# EAGLE design InkTime (EAGLE 9.7.0)

## Sheet 1 of 2
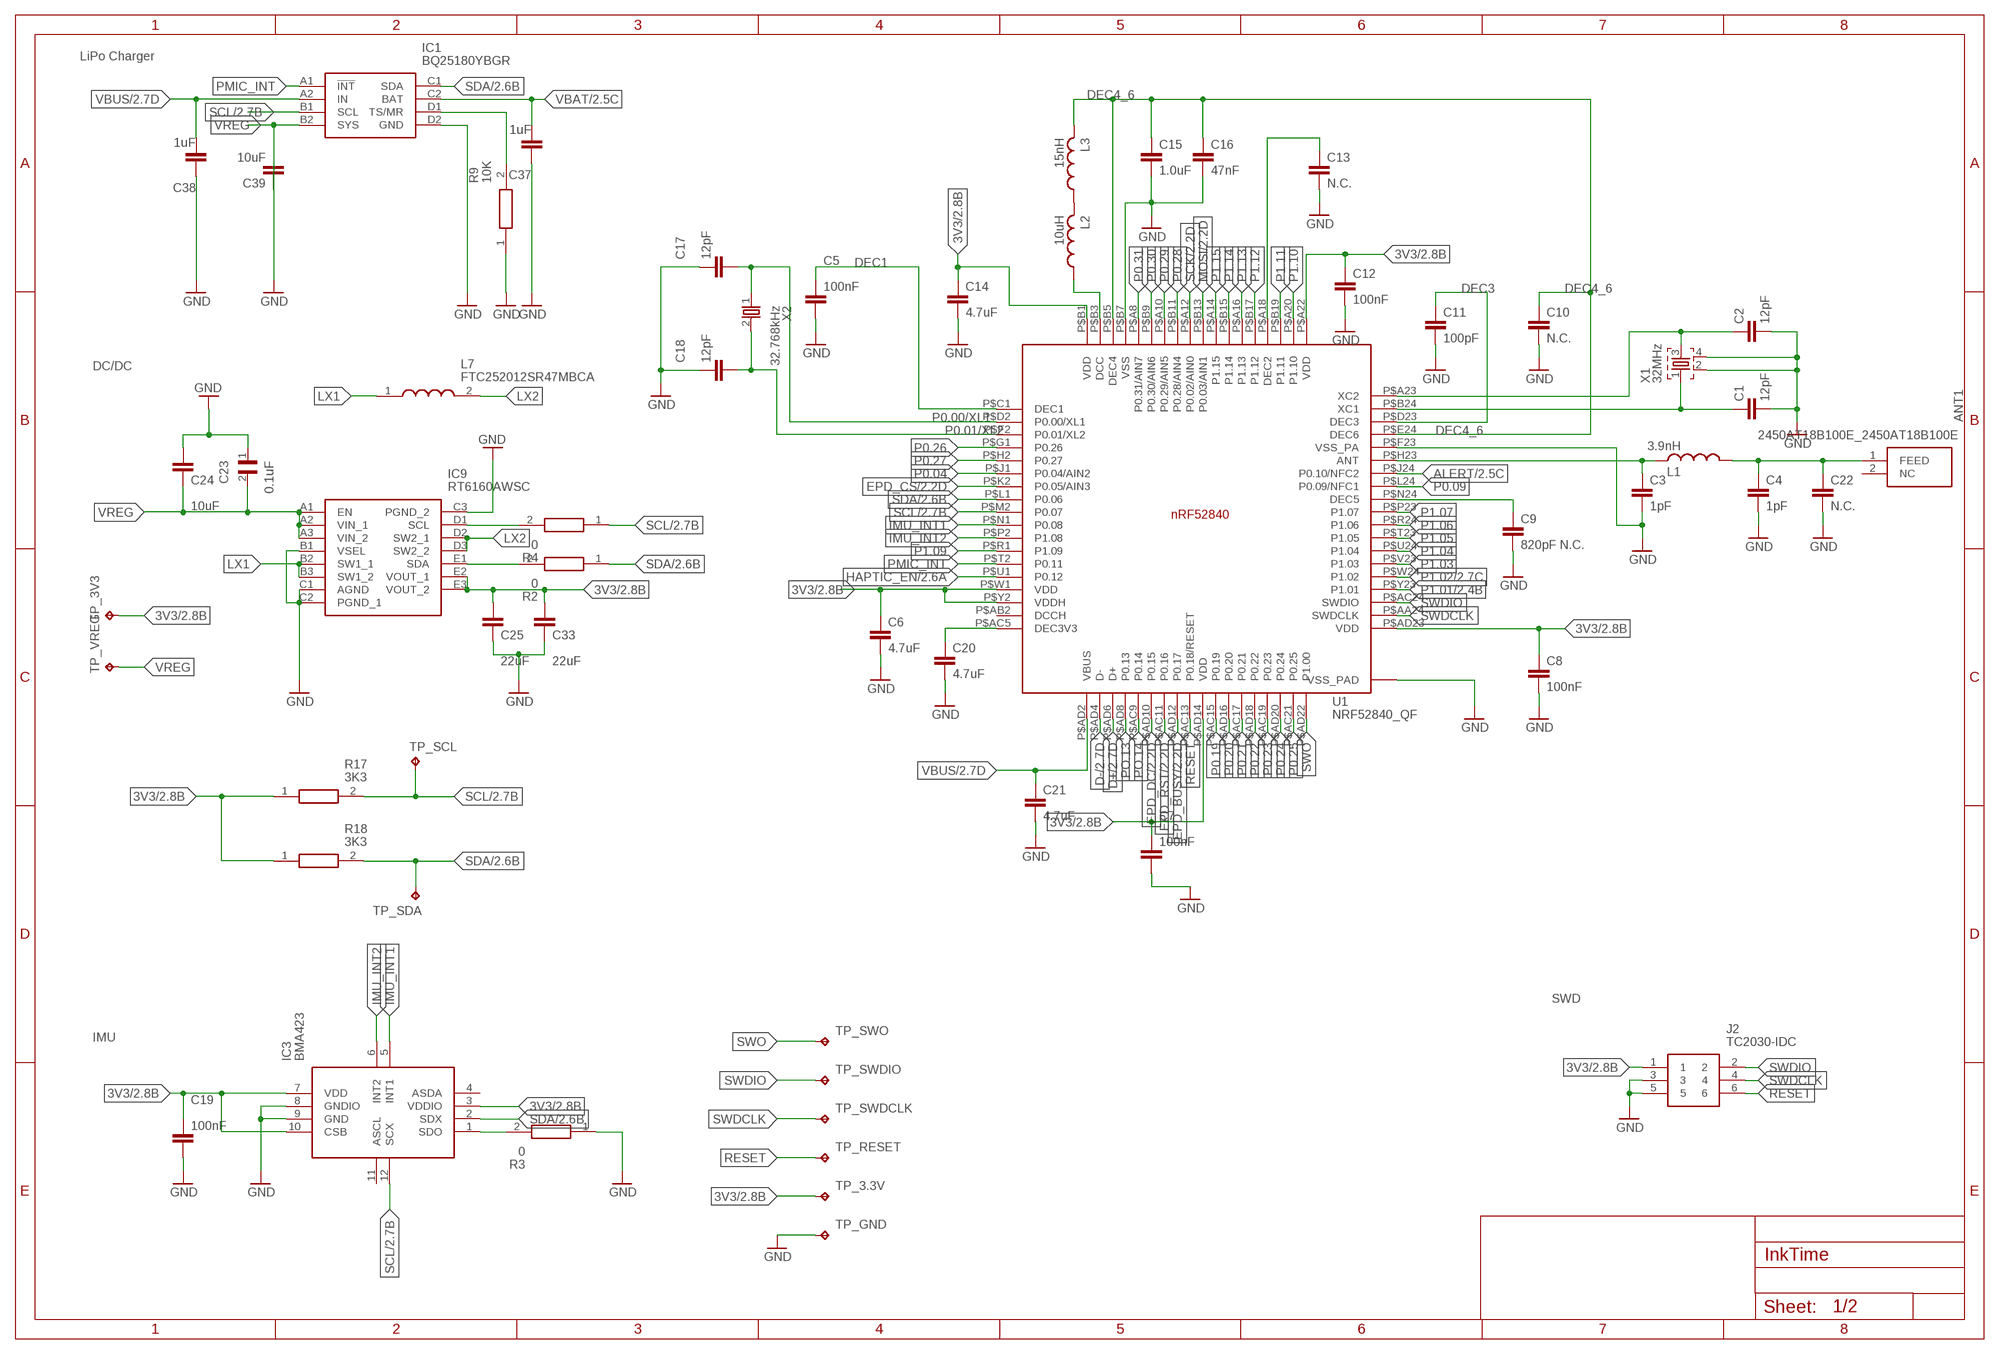
[diagram p0: schematic, sheet 1]

### Parts
ANT1  2450AT18B100E_2450AT18B100E  [2450AT18B100E_ANTC3216X140N]
C1  12pF  NORDIC_NRF_3_CAPACITOR_0201_L  [NORDIC_NRF_3_RESC0201_L]
C2  12pF  NORDIC_NRF_3_CAPACITOR_0201_L  [NORDIC_NRF_3_RESC0201_L]
C3  1pF  NORDIC_NRF_3_CAPACITOR_0201_L  [NORDIC_NRF_3_RESC0201_L]
C4  1pF  NORDIC_NRF_3_CAPACITOR_0201_L  [NORDIC_NRF_3_RESC0201_L]
C5  100nF  NORDIC_NRF_3_CAPACITOR_0201_L  [NORDIC_NRF_3_RESC0201_L]
C6  4.7uF  PERFECT_0402_CAP_0402  [PERFECT_0402_0402]
C7  100nF  NORDIC_NRF_3_CAPACITOR_0201_L  [NORDIC_NRF_3_RESC0201_L]
C8  100nF  NORDIC_NRF_3_CAPACITOR_0201_L  [NORDIC_NRF_3_RESC0201_L]
C9  820pF N.C.  NORDIC_NRF_3_CAPACITOR_0201_L  [NORDIC_NRF_3_RESC0201_L]
C10  N.C.  NORDIC_NRF_3_CAPACITOR_0201_L  [NORDIC_NRF_3_RESC0201_L]
C11  100pF  NORDIC_NRF_3_CAPACITOR_0201_L  [NORDIC_NRF_3_RESC0201_L]
C12  100nF  NORDIC_NRF_3_CAPACITOR_0201_L  [NORDIC_NRF_3_RESC0201_L]
C13  N.C.  NORDIC_NRF_3_CAPACITOR_0201_L  [NORDIC_NRF_3_RESC0201_L]
C14  4.7uF  PERFECT_0402_CAP_0402  [PERFECT_0402_0402]
C15  1.0uF  PERFECT_0402_CAP_0402  [PERFECT_0402_0402]
C16  47nF  NORDIC_NRF_3_CAPACITOR_0201_L  [NORDIC_NRF_3_RESC0201_L]
C17  12pF  NORDIC_NRF_3_CAPACITOR_0201_L  [NORDIC_NRF_3_RESC0201_L]
C18  12pF  NORDIC_NRF_3_CAPACITOR_0201_L  [NORDIC_NRF_3_RESC0201_L]
C19  100nF  NORDIC_NRF_3_CAPACITOR_0201_L  [NORDIC_NRF_3_RESC0201_L]
C20  4.7uF  PERFECT_0402_CAP_0402  [PERFECT_0402_0402]
C21  4.7uF  PERFECT_0402_CAP_0402  [PERFECT_0402_0402]
C22  N.C.  NORDIC_NRF_3_CAPACITOR_0201_L  [NORDIC_NRF_3_RESC0201_L]
C23  0.1uF  GRM011R60J152KE01L_1_GRM011R60J152KE01L  [GRM011R60J152KE01L_1_0201]
C24  10uF  PERFECT_0402_CAP_0402  [PERFECT_0402_0402]
C25  22uF  PERFECT_0402_CAP_0402  [PERFECT_0402_0402]
C33  22uF  PERFECT_0402_CAP_0402  [PERFECT_0402_0402]
C37  1uF  NORDIC_NRF_3_CAPACITOR_0402_L  [NORDIC_NRF_3_RESC0402_L]
C38  1uF  NORDIC_NRF_3_CAPACITOR_0402_L  [NORDIC_NRF_3_RESC0402_L]
C39  10uF  NORDIC_NRF_3_CAPACITOR_0402_L  [NORDIC_NRF_3_RESC0402_L]
IC1  BQ25180YBGR  BQ25180YBGR_BQ25180YBGR  [BQ25180YBGR_BGA8C40P2X4_100X155X50]
IC3  BMA423  BMA423_BMA423  [BMA423_BMA423]
IC9  RT6160AWSC  RT6160AWSC_RT6160AWSC  [RT6160AWSC_BGA15C40P3X5_140X230X60]
J2  TC2030-IDC  TC2030-IDC_TC2030-IDC  [TC2030-IDC_TC2030IDC]
L1  3.9nH  NORDIC_NRF_2_INDUCTOR_0402_L  [NORDIC_NRF_2_RESC0402_L]
L2  10uH  NORDIC_NRF_2_INDUCTOR_0402_L  [NORDIC_NRF_2_RESC0402_L]
L3  15nH  NORDIC_NRF_2_INDUCTOR_0402_L  [NORDIC_NRF_2_RESC0402_L]
L7  FTC252012SR47MBCA  MLP2016SR47MT0S1_FTC252012SR47MBCA  [MLP2016SR47MT0S1_INDC2016X100N]
R2  0  ERA-1AEB3401C_CPF0201D7K68C1  [ERA-1AEB3401C_0201]
R3  0  CPF0201D7K68C1_CPF0201D7K68C1  [CPF0201D7K68C1_0201]
R4  0  ERA-1AEB3401C_CPF0201D7K68C1  [ERA-1AEB3401C_0201]
R9  10K  ERA-1AEB3401C_CPF0201D7K68C1  [ERA-1AEB3401C_0201]
R17  3K3  ERA-1AEB3401C_CPF0201D7K68C1  [ERA-1AEB3401C_0201]
R18  3K3  ERA-1AEB3401C_CPF0201D7K68C1  [ERA-1AEB3401C_0201]
TP_3.3V  HECTOR_WATCH_1_TPTP20R  [HECTOR_WATCH_1_TP20R]
TP_3V3  HECTOR_WATCH_1_TPTP20R  [HECTOR_WATCH_1_TP20R]
TP_GND  HECTOR_WATCH_1_TPTP20R  [HECTOR_WATCH_1_TP20R]
TP_RESET  HECTOR_WATCH_1_TPTP20R  [HECTOR_WATCH_1_TP20R]
TP_SCL  HECTOR_WATCH_1_TPTP20R  [HECTOR_WATCH_1_TP20R]
TP_SDA  HECTOR_WATCH_1_TPTP20R  [HECTOR_WATCH_1_TP20R]
TP_SWDCLK  HECTOR_WATCH_1_TPTP20R  [HECTOR_WATCH_1_TP20R]
TP_SWDIO  HECTOR_WATCH_1_TPTP20R  [HECTOR_WATCH_1_TP20R]
TP_SWO  HECTOR_WATCH_1_TPTP20R  [HECTOR_WATCH_1_TP20R]
TP_VREG  HECTOR_WATCH_1_TPTP20R  [HECTOR_WATCH_1_TP20R]
U1  NRF52840_QF  NORDIC_NRF_4_NRF52840_QF  [NORDIC_NRF_4_AQFN50P700X700X85_HS-74N]
X1  32MHz  NORDIC_NRF_XTAL_32MHZ  [NORDIC_NRF_BT-XTAL_2016_N]
X2  32.768kHz  NORDIC_NRF_1_XTAL_32KHZ  [NORDIC_NRF_1_XTAL_3215_N]

### Nets
3V3: C6.1 C7.1 C8.1 C12.1 C14.1 C19.1 C25.1 C33.1 IC3.3(VDDIO) IC3.7(VDD) IC3.10(CSB) IC9.E2(VOUT_1) IC9.E3(VOUT_2) J2.1 R17.1 R18.1 TP_3.3V.TP TP_3V3.TP U1.P$A22(VDD) U1.P$AD14(VDD) U1.P$AD23(VDD) U1.P$B1(VDD) U1.P$W1(VDD) U1.P$Y2(VDDH) ; also sheet 2
ALERT: U1.P$J24(P0.10/NFC2) ; also sheet 2
D+: U1.P$AD6(D+) ; also sheet 2
D-: U1.P$AD4(D-) ; also sheet 2
DEC1: C5.1 U1.P$C1(DEC1)
DEC3: C11.1 U1.P$D23(DEC3)
DEC4_6: C10.1 C15.1 C16.1 L3.2 U1.P$B5(DEC4) U1.P$E24(DEC6)
EPD_BUSY: U1.P$AD12(P0.17) ; also sheet 2
EPD_CS: U1.P$K2(P0.05/AIN3) ; also sheet 2
EPD_DC: U1.P$AD10(P0.15) ; also sheet 2
EPD_RST: U1.P$AC11(P0.16) ; also sheet 2
GND: C1.2 C2.2 C3.2 C4.2 C5.2 C6.2 C7.2 C8.2 C9.2 C10.2 C11.2 C12.2 C13.2 C14.2 C15.2 C16.2 C17.1 C18.1 C19.2 C20.2 C21.2 C22.2 C23.1 C24.1 C25.2 C33.2 C37.1 C38.1 C39.2 IC1.D2(GND) IC3.8(GNDIO) IC3.9(GND) IC9.B1(VSEL) IC9.C1(AGND) IC9.C2(PGND_1) IC9.C3(PGND_2) J2.3 J2.5 R3.1 R9.1 TP_GND.TP U1.P$74(VSS_PAD) U1.P$75(VSS_PAD) U1.P$76(VSS_PAD) U1.P$77(VSS_PAD) U1.P$78(VSS_PAD) U1.P$79(VSS_PAD) U1.P$80(VSS_PAD) U1.P$81(VSS_PAD) U1.P$82(VSS_PAD) U1.P$83(VSS_PAD) U1.P$84(VSS_PAD) U1.P$85(VSS_PAD) U1.P$86(VSS_PAD) U1.P$87(VSS_PAD) U1.P$88(VSS_PAD) U1.P$89(VSS_PAD) U1.P$90(VSS_PAD) U1.P$B7(VSS) U1.P$F23(VSS_PA) X1.2 X1.4 ; also sheet 2
HAPTIC_EN: U1.P$U1(P0.12) ; also sheet 2
IMU_INT1: IC3.5(INT1) U1.P$N1(P0.08)
IMU_INT2: IC3.6(INT2) U1.P$P2(P1.08)
LX1: IC9.B2(SW1_1) IC9.B3(SW1_2) L7.1
LX2: IC9.D2(SW2_1) IC9.D3(SW2_2) L7.2
MOSI: U1.P$B13(P0.03/AIN1) ; also sheet 2
N$1: ANT1.1(FEED) C4.1 C22.1 L1.2
N$2: IC9.D1(SCL) R4.2
N$3: IC1.D1(TS/MR) R9.2
N$4: C2.1 U1.P$A23(XC2) X1.3
N$5: IC9.E1(SDA) R2.2
N$7: L2.2 L3.1
N$8: IC3.1(SDO) R3.2
N$9: C1.1 U1.P$B24(XC1) X1.1
N$10: C3.1 L1.1 U1.P$H23(ANT)
N$14: C9.1 U1.P$N24(DEC5)
N$20: C20.1 U1.P$AC5(DEC3V3)
N$22: L2.1 U1.P$B3(DCC)
N$35: C13.1 U1.P$A18(DEC2)
P0.00/XL1: C17.2 U1.P$D2(P0.00/XL1) X2.1
P0.01/XL2: C18.2 U1.P$F2(P0.01/XL2) X2.2
P0.04: U1.P$J1(P0.04/AIN2)
P0.09: U1.P$L24(P0.09/NFC1)
P0.19: U1.P$AC15(P0.19)
P0.20: U1.P$AD16(P0.20)
P0.21: U1.P$AC17(P0.21)
P0.22: U1.P$AD18(P0.22)
P0.23: U1.P$AC19(P0.23)
P0.24: U1.P$AD20(P0.24)
P0.25: U1.P$AC21(P0.25)
P0.26: U1.P$G1(P0.26)
P0.27: U1.P$H2(P0.27)
P0.28: U1.P$B11(P0.28/AIN4)
P0.29: U1.P$A10(P0.29/AIN5)
P0.30: U1.P$B9(P0.30/AIN6)
P0.31: U1.P$A8(P0.31/AIN7)
P1.01: U1.P$Y23(P1.01) ; also sheet 2
P1.02: U1.P$W24(P1.02) ; also sheet 2
P1.03: U1.P$V23(P1.03)
P1.04: U1.P$U24(P1.04)
P1.05: U1.P$T23(P1.05)
P1.06: U1.P$R24(P1.06)
P1.07: U1.P$P23(P1.07)
P1.09: U1.P$R1(P1.09)
P1.10: U1.P$A20(P1.10)
P1.11: U1.P$B19(P1.11)
P1.12: U1.P$B17(P1.12)
P1.13: U1.P$A16(P1.13)
P1.14: U1.P$B15(P1.14)
P1.15: U1.P$A14(P1.15)
PMIC_INT: IC1.A1(!INT) U1.P$T2(P0.11)
PO.13: U1.P$AD8(P0.13)
PO.14: U1.P$AC9(P0.14)
RESET: J2.6 TP_RESET.TP U1.P$AC13(P0.18/RESET)
SCK: U1.P$A12(P0.02/AIN0) ; also sheet 2
SCL: IC1.B1(SCL) IC3.12(SCX) R4.1 R17.2 TP_SCL.TP U1.P$M2(P0.07) ; also sheet 2
SDA: IC1.C1(SDA) IC3.2(SDX) R2.1 R18.2 TP_SDA.TP U1.P$L1(P0.06) ; also sheet 2
SWDCLK: J2.4 TP_SWDCLK.TP U1.P$AA24(SWDCLK)
SWDIO: J2.2 TP_SWDIO.TP U1.P$AC24(SWDIO)
SWO: TP_SWO.TP U1.P$AD22(P1.00)
VBAT: C37.2 IC1.C2(BAT) ; also sheet 2
VBUS: C21.1 C38.2 IC1.A2(IN) U1.P$AD2(VBUS) ; also sheet 2
VREG: C23.2 C24.2 C39.1 IC1.B2(SYS) IC9.A1(EN) IC9.A2(VIN_1) IC9.A3(VIN_2) TP_VREG.TP
Unconnected: ANT1.2(NC) IC3.4(ASDA) IC3.11(ASCL) U1.P$AB2(DCCH)

### Notes on the sheet
- LiPo Charger
- DC/DC
- SWD
- IMU

## Sheet 2 of 2
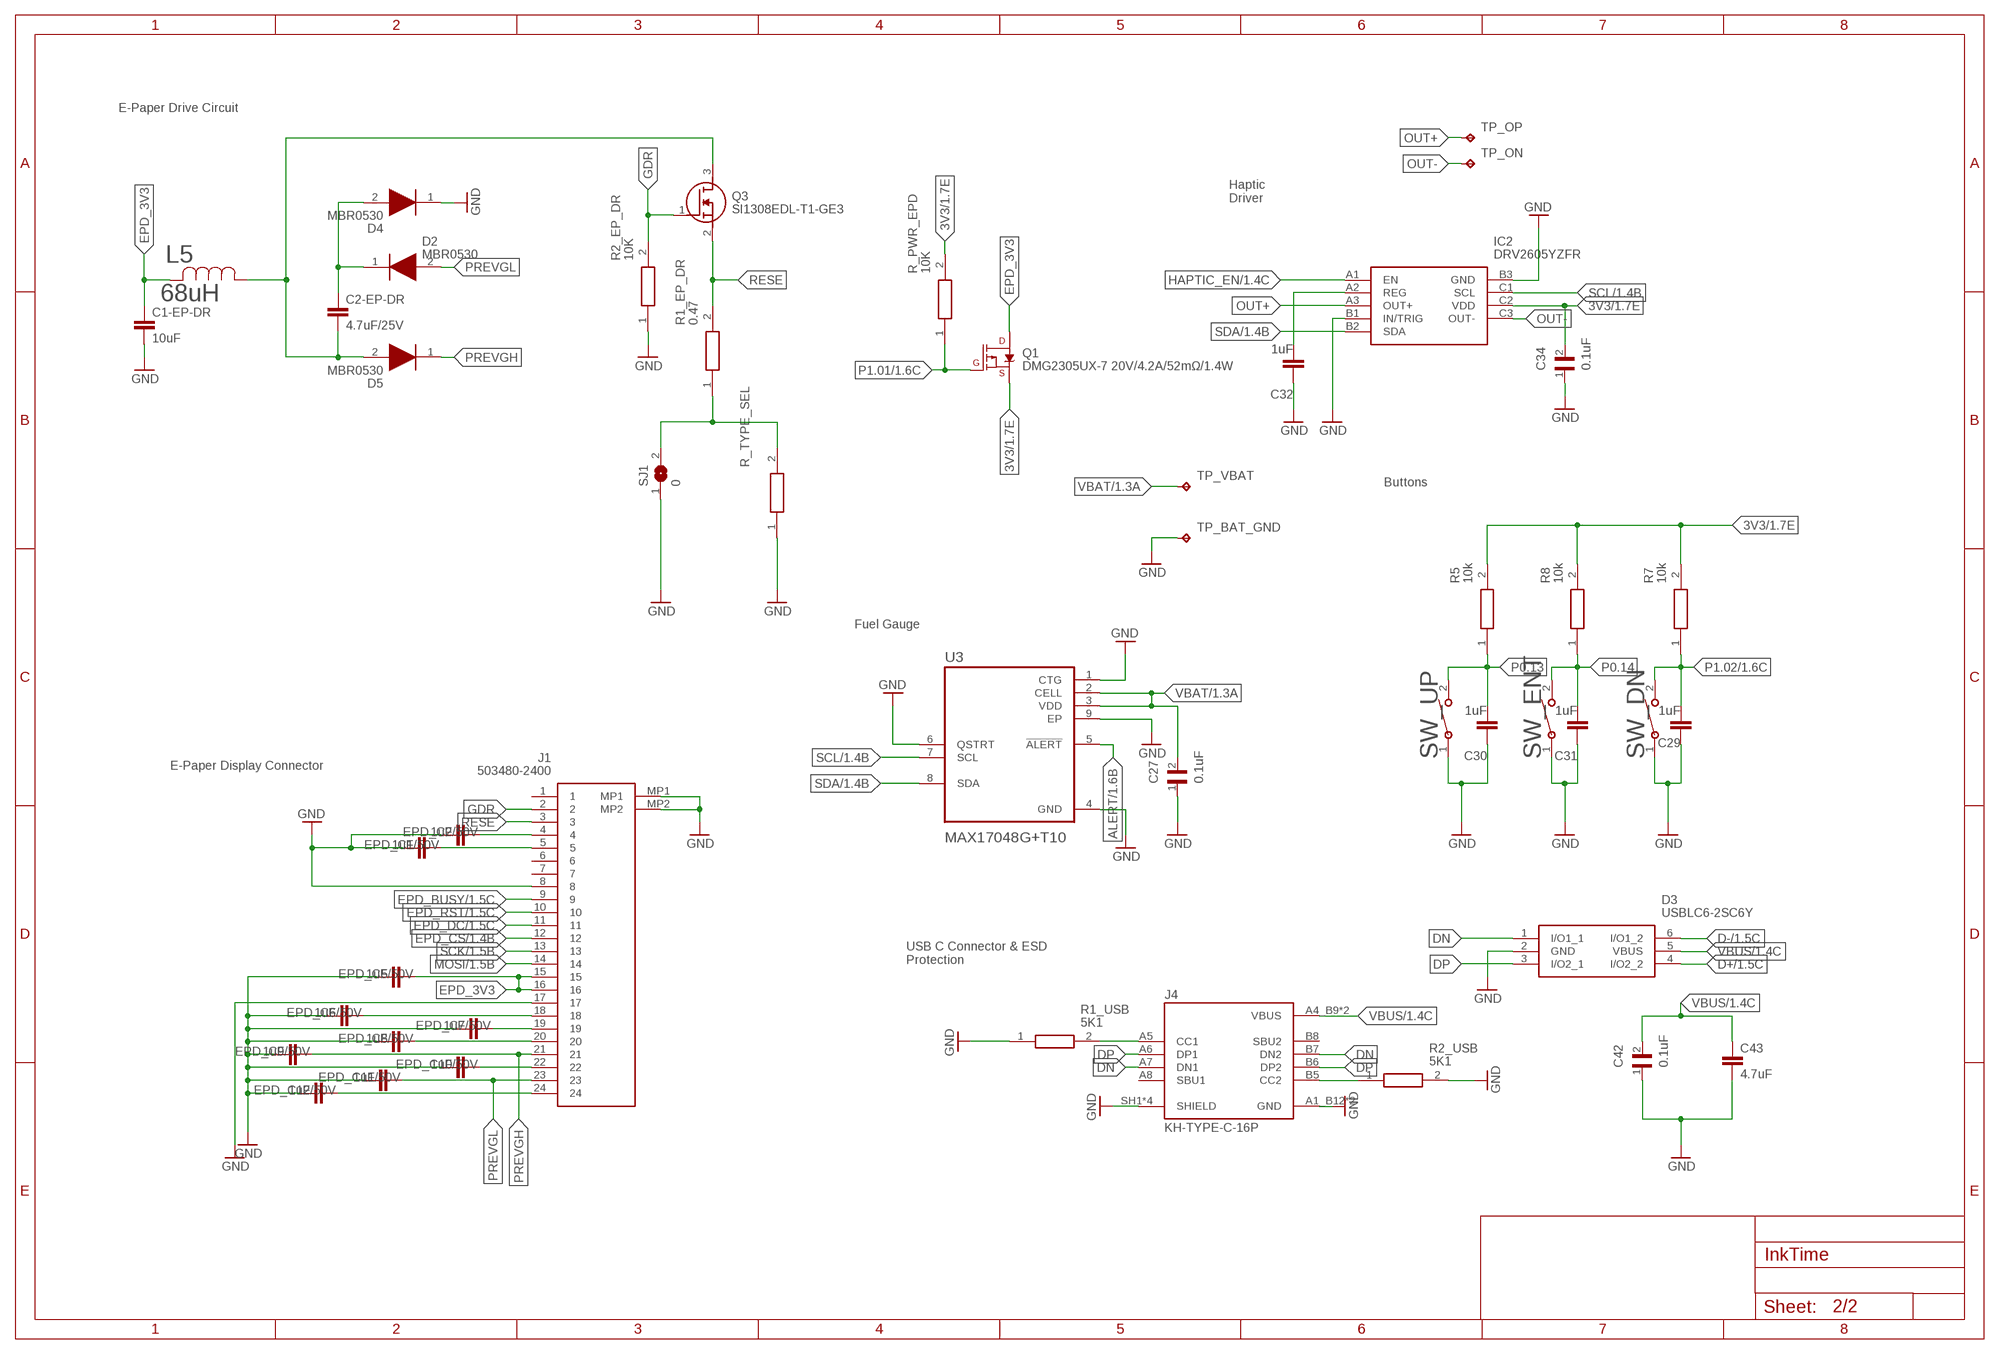
[diagram p1: schematic, sheet 2]

### Parts
C1-EP-DR  10uF  PERFECT_0402_CAP_0402  [PERFECT_0402_0402]
C2-EP-DR  4.7uF/25V  PERFECT_0402_CAP_0402  [PERFECT_0402_0402]
C27  0.1uF  GRM011R60J152KE01L_2_GRM011R60J152KE01L  [GRM011R60J152KE01L_2_CAPC0201X13N]
C29  1uF  NORDIC_NRF_3_CAPACITOR_0402_L  [NORDIC_NRF_3_RESC0402_L]
C30  1uF  NORDIC_NRF_3_CAPACITOR_0402_L  [NORDIC_NRF_3_RESC0402_L]
C31  1uF  NORDIC_NRF_3_CAPACITOR_0402_L  [NORDIC_NRF_3_RESC0402_L]
C32  1uF  NORDIC_NRF_3_CAPACITOR_0402_L  [NORDIC_NRF_3_RESC0402_L]
C34  0.1uF  GRM011R60J152KE01L_2_GRM011R60J152KE01L  [GRM011R60J152KE01L_2_CAPC0201X13N]
C42  0.1uF  GRM011R60J152KE01L_2_GRM011R60J152KE01L  [GRM011R60J152KE01L_2_CAPC0201X13N]
C43  4.7uF  PERFECT_0402_CAP_0402  [PERFECT_0402_0402]
D2  MBR0530  ESP32_C6_LIBRARY_5_MBR0530  [ESP32_C6_LIBRARY_5_SOD3716X135N]
D3  USBLC6-2SC6Y  ESP32_C6_LIBRARY_3_USBLC6-2SC6Y  [ESP32_C6_LIBRARY_3_SOT95P280X145-6N]
D4  MBR0530  ESP32_C6_LIBRARY_5_MBR0530  [ESP32_C6_LIBRARY_5_SOD3716X135N]
D5  MBR0530  ESP32_C6_LIBRARY_5_MBR0530  [ESP32_C6_LIBRARY_5_SOD3716X135N]
EPD_C1  1uF/50V  PERFECT_0402_CAP_0402  [PERFECT_0402_0402]
EPD_C2  1uF/50V  PERFECT_0402_CAP_0402  [PERFECT_0402_0402]
EPD_C5  1uF/50V  PERFECT_0402_CAP_0402  [PERFECT_0402_0402]
EPD_C6  1uF/50V  PERFECT_0402_CAP_0402  [PERFECT_0402_0402]
EPD_C7  1uF/50V  PERFECT_0402_CAP_0402  [PERFECT_0402_0402]
EPD_C8  1uF/50V  PERFECT_0402_CAP_0402  [PERFECT_0402_0402]
EPD_C9  1uF/50V  PERFECT_0402_CAP_0402  [PERFECT_0402_0402]
EPD_C10  1uF/50V  PERFECT_0402_CAP_0402  [PERFECT_0402_0402]
EPD_C11  1uF/50V  PERFECT_0402_CAP_0402  [PERFECT_0402_0402]
EPD_C12  1uF/50V  PERFECT_0402_CAP_0402  [PERFECT_0402_0402]
IC2  DRV2605YZFR  DRV2605YZFR_DRV2605YZFR  [DRV2605YZFR_BGA9C50P3X3_144X144X62]
J1  503480-2400  503480-2400_503480-2400  [503480-2400_5034802400]
J4  KH-TYPE-C-16P  KH-TYPE-C-16P_KH-TYPE-C-16P  [KH-TYPE-C-16P_KINGHELM_KH-TYPE-C-16P]
L5  68uH  ESP32_C6_LIBRARY_2_744043680IND_4828-WE-TPC_WRE  [ESP32_C6_LIBRARY_2_IND_4828-WE-TPC_WRE]
Q1  DMG2305UX-7 20V/4.2A/52mΩ/1.4W  ESP32_C6_LIBRARY_4_ESP32_WROVER_SPARKFUN-DISCRETESEMI_MOSFET_PCH-DMG2305UX-7  [ESP32_C6_LIBRARY_4_ESP32_C6_LIBRARY_4_ESP32_C6_LIBRARY_4_ESP32_C6_LIBRARY_4_ESP32_WROVER_SPARKFUN-DISCRETESEMI_SOT23-3]
Q3  SI1308EDL-T1-GE3  ESP32_C6_LIBRARY_6_SI1308EDL-T1-GE3  [ESP32_C6_LIBRARY_6_SOT65P210X110-3N]
R1_EP_DR  0.47  ERA-1AEB3401C_CPF0201D7K68C1  [ERA-1AEB3401C_0201]
R1_USB  5K1  CPF0201D7K68C1_CPF0201D7K68C1  [CPF0201D7K68C1_0201]
R2_EP_DR  10K  ERA-1AEB3401C_CPF0201D7K68C1  [ERA-1AEB3401C_0201]
R2_USB  5K1  CPF0201D7K68C1_CPF0201D7K68C1  [CPF0201D7K68C1_0201]
R5  10k  CPF0201D7K68C1_CPF0201D7K68C1  [CPF0201D7K68C1_0201]
R7  10k  CPF0201D7K68C1_CPF0201D7K68C1  [CPF0201D7K68C1_0201]
R8  10k  CPF0201D7K68C1_CPF0201D7K68C1  [CPF0201D7K68C1_0201]
R_PWR_EPD  10K  CPF0201D7K68C1_CPF0201D7K68C1  [CPF0201D7K68C1_0201]
R_TYPE_SEL  2.2  ERA-1AEB3401C_CPF0201D7K68C1  [ERA-1AEB3401C_0201]
SJ1  0  ESP32_C6_LIBRARY_7_JUMPER_SJ  [ESP32_C6_LIBRARY_7_JUMPER_SJ]
SW_DN  2025-10-22_07-23-44_LIBRARY_EVP-AKE31ASW_EVP-AKE31A_PAN  [2025-10-22_07-23-44_LIBRARY_SW_EVP-AKE31A_PAN]
SW_ENT  2025-10-22_07-23-44_LIBRARY_EVP-AKE31ASW_EVP-AKE31A_PAN  [2025-10-22_07-23-44_LIBRARY_SW_EVP-AKE31A_PAN]
SW_UP  2025-10-22_07-23-44_LIBRARY_EVP-AKE31ASW_EVP-AKE31A_PAN  [2025-10-22_07-23-44_LIBRARY_SW_EVP-AKE31A_PAN]
TP_BAT_GND  HECTOR_WATCH_1_TPTP20R  [HECTOR_WATCH_1_TP20R]
TP_ON  HECTOR_WATCH_1_TPTP20R  [HECTOR_WATCH_1_TP20R]
TP_OP  HECTOR_WATCH_1_TPTP20R  [HECTOR_WATCH_1_TP20R]
TP_VBAT  HECTOR_WATCH_1_TPTP20R  [HECTOR_WATCH_1_TP20R]
U3  MAX17048G+T10  ESP32_C6_LIBRARY_MAX17048G+T10  [ESP32_C6_LIBRARY_SON50P200X200X80-9N]

### Nets
3V3: C34.2 IC2.C2(VDD) Q1.2(S) R5.2 R7.2 R8.2 R_PWR_EPD.2 ; also sheet 1
ALERT: U3.5(!ALERT) ; also sheet 1
D+: D3.4(I/O2_2) ; also sheet 1
D-: D3.6(I/O1_2) ; also sheet 1
DN: D3.1(I/O1_1) J4.A7(DN1) J4.B7(DN2)
DP: D3.3(I/O2_1) J4.A6(DP1) J4.B6(DP2)
EPD_3V3: C1-EP-DR.1 EPD_C5.2 J1.15 J1.16 L5.2 Q1.3(D)
EPD_BUSY: J1.9 ; also sheet 1
EPD_CS: J1.12 ; also sheet 1
EPD_DC: J1.11 ; also sheet 1
EPD_RST: J1.10 ; also sheet 1
GDR: J1.2 Q3.1(G) R2_EP_DR.2
GND: C1-EP-DR.2 C27.1 C29.1 C30.1 C31.1 C32.1 C34.1 C42.1 C43.2 D3.2(GND) D4.1(K) EPD_C1.1 EPD_C2.1 EPD_C5.1 EPD_C6.1 EPD_C7.1 EPD_C8.1 EPD_C9.1 EPD_C10.1 EPD_C11.1 EPD_C12.1 IC2.B1(IN/TRIG) IC2.B3(GND) J1.8 J1.17 J1.MP1 J1.MP2 J4.A1_B12(GND) J4.A12_B1(GND) J4.SH1(SHIELD) J4.SH2(SHIELD) J4.SH3(SHIELD) J4.SH4(SHIELD) R1_USB.1 R2_EP_DR.1 R2_USB.2 R_TYPE_SEL.1 SJ1.1 SW_DN.1 SW_ENT.1 SW_UP.1 TP_BAT_GND.TP U3.1(CTG) U3.4(GND) U3.6(QSTRT) U3.9(EP) ; also sheet 1
HAPTIC_EN: IC2.A1(EN) ; also sheet 1
MOSI: J1.14 ; also sheet 1
N$6: J4.A5(CC1) R1_USB.2
N$11: C32.2 IC2.A2(REG)
N$13: C2-EP-DR.1 D2.1(K) D4.2(A)
N$15: R1_EP_DR.1 R_TYPE_SEL.2 SJ1.2
N$16: C2-EP-DR.2 D5.2(A) L5.1 Q3.3(D)
N$17: EPD_C2.2 J1.4
N$18: EPD_C1.2 J1.5
N$26: J4.B5(CC2) R2_USB.1
N$30: EPD_C6.2 J1.18
N$31: EPD_C7.2 J1.19
N$32: EPD_C8.2 J1.20
N$34: EPD_C10.2 J1.22
N$37: EPD_C12.2 J1.24
OUT+: IC2.A3(OUT+) TP_OP.TP
OUT-: IC2.C3(OUT-) TP_ON.TP
P0.13: C30.2 R5.1 SW_UP.2
P0.14: C31.2 R8.1 SW_ENT.2
P1.01: Q1.1(G) R_PWR_EPD.1 ; also sheet 1
P1.02: C29.2 R7.1 SW_DN.2 ; also sheet 1
PREVGH: D5.1(K) EPD_C9.2 J1.21
PREVGL: D2.2(A) EPD_C11.2 J1.23
RESE: J1.3 Q3.2(S) R1_EP_DR.2
SCK: J1.13 ; also sheet 1
SCL: IC2.C1(SCL) U3.7(SCL) ; also sheet 1
SDA: IC2.B2(SDA) U3.8(SDA) ; also sheet 1
VBAT: C27.2 TP_VBAT.TP U3.2(CELL) U3.3(VDD) ; also sheet 1
VBUS: C42.2 C43.1 D3.5(VBUS) J4.A4_B9(VBUS) J4.A9_B4(VBUS) ; also sheet 1
Unconnected: J1.1 J1.6 J1.7 J4.A8(SBU1) J4.B8(SBU2)

### Notes on the sheet
- E-Paper Drive Circuit
- Haptic
  Driver
- Buttons
- Fuel Gauge
- E-Paper Display Connector
- USB C Connector & ESD
  Protection

## Library data of the parts
ANT1 = InkTime_v5:2450AT18B100E_2450AT18B100E: Antennas 2.45GHz ANTENNA Source: Datasheet <https://www.johansontechnology.com/datasheets/2450AT18B100/2450AT18B100.pdf>
C1-C5 C7-C13 C16-C19 C22 C29-C32 C37-C39 = InkTime_v5:NORDIC_NRF_3_CAPACITOR: Generic chip capacitor
C1-EP-DR C2-EP-DR C6 C14 C15 C20 C21 C24 C25 C33 C43 EPD_C1 EPD_C2 EPD_C5-EPD_C12 = InkTime_v5:PERFECT_0402_CAP_0402: 0402 (1005 Metric) Nick Garner - TeleSense
C23 = InkTime_v5:GRM011R60J152KE01L_1_GRM011R60J152KE01L: Check availability <https://pricing.snapeda.com/parts/GRM011R60J152KE01L/Murata/view-part?ref=eda>
C27 C34 C42 = InkTime_v5:GRM011R60J152KE01L_2_GRM011R60J152KE01L: Check availability <https://pricing.snapeda.com/parts/GRM011R60J152KE01L/Murata/view-part?ref=eda>
D2 D4 D5 = InkTime_v5:ESP32_C6_LIBRARY_5_MBR0530: ON SEMICONDUCTOR - MBR0530 - DIODE, SCHOTTKY, 0.5A, 30V, SOD-123 Source: Datasheet <http://www.onsemi.com/pub/Collateral/MBR0530T1-D.PDF> Check availability <https://pricing.snapeda.com/parts/MBR0530/ON%20Semiconductor/view-part?ref=eda>
D3 = InkTime_v5:ESP32_C6_LIBRARY_3_USBLC6-2SC6Y: Low Cap. ESD Protection Auto SOT-23-6 STMicroelectronics USBLC6-2SC6Y, Dual Uni-Directional TVS Diode Array, 6-Pin SOT-23 Source: Datasheet <https://componentsearchengine.com/Datasheets/1/USBLC6-2SC6Y.pdf> Check availability <https://pricing.snapeda.com/parts/USBLC6-2SC6Y/STMicroelectronics/view-part?ref=eda>
IC1 = InkTime_v5:BQ25180YBGR_BQ25180YBGR: Charger IC Lithium Ion/Polymer, Lithium Iron Phosphate 8-DSBGA (1.6x1.1) Source: Datasheet <https://www.ti.com/lit/ds/symlink/bq25180.pdf?ts=1650264094470&ref_url=https%3A%2F%2Fwww.ti.com%2Fproduct%2FBQ25180>
IC2 = InkTime_v5:DRV2605YZFR_DRV2605YZFR: Haptic Driver for ERM/LRA with Built-In Library and Smart Loop Architecture Source: Datasheet <http://www.ti.com/lit/gpn/drv2605>
IC3 = InkTime_v5:BMA423_BMA423: Accelerometers Triaxial low-g 12bit Acceleration Sensor Source: Datasheet <https://www.mouser.com/datasheet/2/783/BST-BMA423-DS000-1509600.pdf>
IC9 = InkTime_v5:RT6160AWSC_RT6160AWSC: Buck-Boost Regulator Positive Output Step-Up/Step-Down I2C DC-DC Controller IC 15-WL-CSP (BSC) (1.4x2.3) Source: Datasheet <https://www.richtek.com/SaveDownload.aspx?specid=RT6160A>
J1 = InkTime_v5:503480-2400_503480-2400: FFC & FPC Connectors 0.5mm FPC RA SMT Dual Contact 24Ckt Source: Datasheet <https://componentsearchengine.com/Datasheets/1/503480-2400.pdf>
J2 = InkTime_v5:TC2030-IDC_TC2030-IDC: CABLE ADAPTER 6 POS Source: Datasheet <https://datasheet.datasheetarchive.com/originals/distributors/Datasheets_SAMA/62bc384e093448baaaa63dbd0b9d8707.pdf>
J4 = InkTime_v5:KH-TYPE-C-16P_KH-TYPE-C-16P: Check availability <https://pricing.snapeda.com/parts/KH-TYPE-C-16P/kinghelm/view-part?ref=eda>
L1-L3 = InkTime_v5:NORDIC_NRF_2_INDUCTOR: Generic chip inductor
L5 = InkTime_v5:ESP32_C6_LIBRARY_2_744043680
L7 = InkTime_v5:MLP2016SR47MT0S1_FTC252012SR47MBCA: SMD / SMT Inductors (Coils), L=0.47?H, L x W x T : Source: Datasheet <https://product.tdk.com/system/files/dam/doc/product/inductor/inductor/smd/catalog/inductor_commercial_power_mlp2016_en.pdf>
Q1 = InkTime_v5:ESP32_C6_LIBRARY_4_ESP32_WROVER_SPARKFUN-DISCRETESEMI_MOSFET_PCH: P-channel MOSFETs Voltage controlled devices that allow control of high current outputs. SparkFun Products: SparkFun ESP32 Thing <https://www.sparkfun.com/products/13907> SparkFun ESP8266 Thing <https://www.sparkfun.com/products/13231> SparkFun Pi Servo HAT V2 <https://www.sparkfun.com/products/15316> DMG2305UX-7 (20V/4.2A/SOT23-3)
Q3 = InkTime_v5:ESP32_C6_LIBRARY_6_SI1308EDL-T1-GE3: MOSFET N-Ch 30V 1.5A TrenchFET SC70 Vishay Si1308EDL-T1-GE3 N-channel MOSFET Transistor, 1.5 A, 30 V, 3-Pin SC-70 Source: Datasheet <https://componentsearchengine.com/Datasheets/1/SI1308EDL-T1-GE3.pdf> Check availability <https://pricing.snapeda.com/parts/SI1308EDL-T1-GE3/Vishay%20Siliconix/view-part?ref=eda>
R1_EP_DR R2 R2_EP_DR R4 R9 R17 R18 R_TYPE_SEL = InkTime_v5:ERA-1AEB3401C_CPF0201D7K68C1: 7.68k 0201 Thin Film Surface Mount Fixed Resistor +/-0.5% 0.031W CPF0201D7K68C1 Source: Datasheet <http://www.te.com/commerce/DocumentDelivery/DDEController?Action=showdoc&DocId=Data Sheet1773200-1ApdfEnglishENG_DS_1773200-1_A.pdf4-2176215-6>
R1_USB R2_USB R3 R5 R7 R8 R_PWR_EPD = InkTime_v5:CPF0201D7K68C1_CPF0201D7K68C1: 7.68k 0201 Thin Film Surface Mount Fixed Resistor +/-0.5% 0.031W CPF0201D7K68C1 Source: Datasheet <http://www.te.com/commerce/DocumentDelivery/DDEController?Action=showdoc&DocId=Data Sheet1773200-1ApdfEnglishENG_DS_1773200-1_A.pdf4-2176215-6>
SJ1 = InkTime_v5:ESP32_C6_LIBRARY_7_JUMPER_SJ: SMD solder JUMPER
SW_DN SW_ENT SW_UP = InkTime_v5:2025-10-22_07-23-44_LIBRARY_EVP-AKE31A
TP_3.3V TP_3V3 TP_BAT_GND TP_GND TP_ON TP_OP TP_RESET TP_SCL TP_SDA TP_SWDCLK TP_SWDIO TP_SWO TP_VBAT TP_VREG = InkTime_v5:HECTOR_WATCH_1_TP: Test pad
U1 = InkTime_v5:NORDIC_NRF_4_NRF52840_QF: nRF52840 Features Advanced Single chip 2.4 GHz multi-protocol SoC 32-bit ARM Cortex-M4F Processor 1.7v to 5.5v operation 1MB flash + 256kB RAM Bluetooth 5 support for long range and high throughput 802.15.4 radio support On-chip NFC PPI –Programmable Peripheral Interconnect Automated power management system with automatic power management of each peripheral Configurable I/O mapping for analog and digital I/O 48 x GPIO 1 x QSPI 4 x Master/Slave SPI 2 x Two-wire interface (I²C) I²S interface 2 x UART 4 x PWM USB 2.0 controller ARM TrustZone CryptoCell-310 Cryptographic and security module AES 128-bit ECB/CCM/AAR hardware accelerator Digital microphone interface (PDM) Quadrature decoder 12-bit ADC Low power comparator On-chip 50Ω balun On-air compatible with nRF52, nRF51 and nRF24 Series Applications Advanced high performance wearables Wearables for secure payments Virtual Reality/Augmented Reality systems Smart Home sensor networks Smart city sensor networks High performance HID controllers Internet of Things (IoT) sensor networks Smart door locks Smart lighting networks Connected white goods
U3 = InkTime_v5:ESP32_C6_LIBRARY_MAX17048G+T10: Check availability <https://pricing.snapeda.com/parts/MAX17048G%2BT10/Analog%20Devices/view-part?ref=eda>
X1 = InkTime_v5:NORDIC_NRF_XTAL_32MHZ
X2 = InkTime_v5:NORDIC_NRF_1_XTAL_32KHZ

## Board
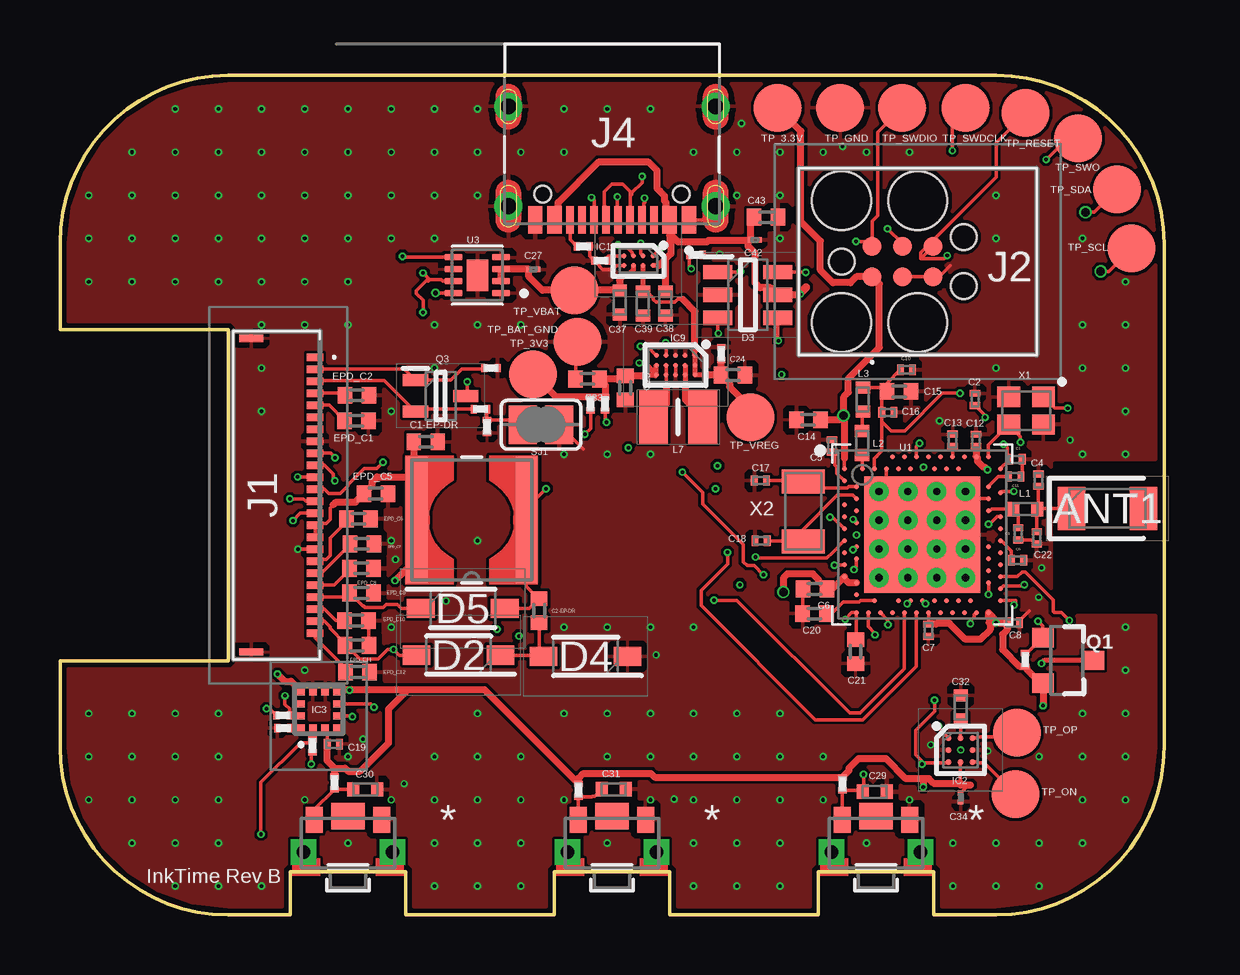
[diagram p2: board, top side]
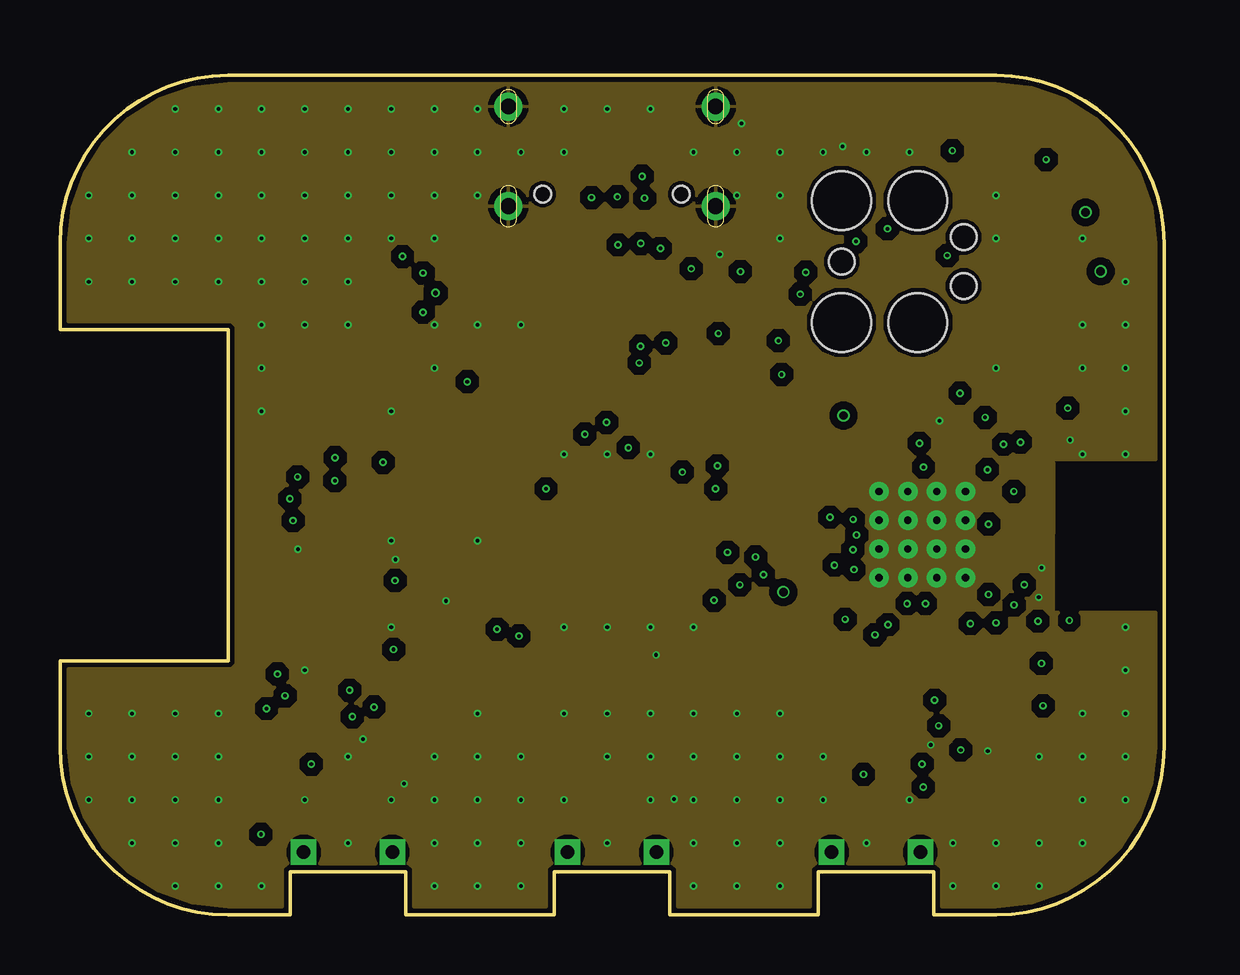
[diagram p3: board, inner layer GND]
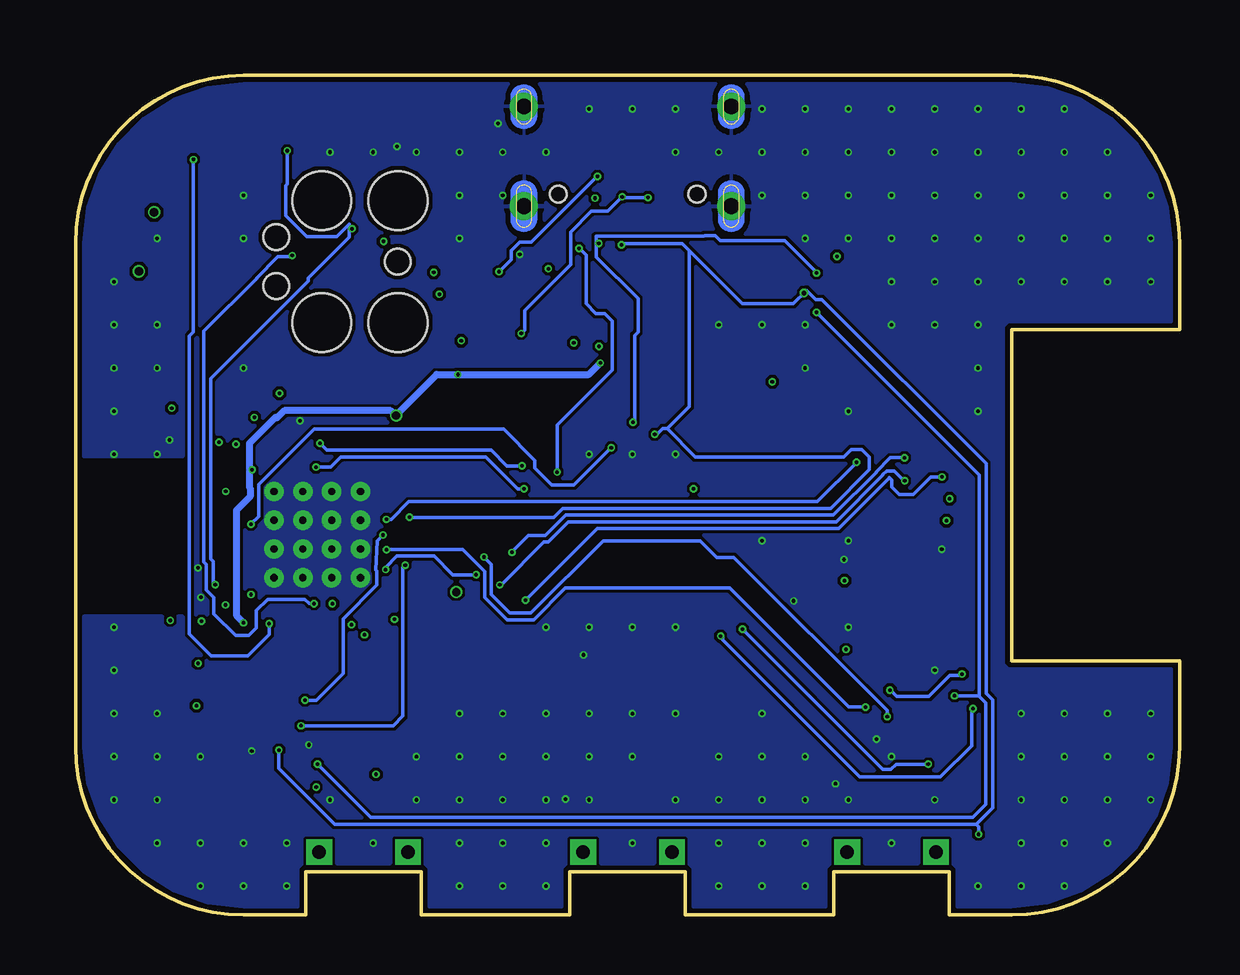
[diagram p4: board, bottom side, seen from below]

Size 46 x 35 mm. Coordinates in mm from the lower left corner, seen from the top.
Outline: 39,0 36.4,0 36.4,1.8 31.6,1.8 31.6,0 25.4,0 25.4,1.8 20.6,1.8 20.6,0 14.4,0 14.4,1.8 9.6,1.8 9.6,0 7,0 arc-90 0,7 0,10.6 7,10.6 7,24.4 0,24.4 0,28 arc-90 7,35 39,35 arc-90 46,28 46,7 arc-90 39,0
Copper layers (1+2*63+16): Top / GND / Bottom / layer 63
Stack-up 4 Layer Stack: Top SilkScreen Epoxy Ink / Top SolderMask SR:Green 0.0254mm Dk 4.3 / Top Surface Finish Lead-Free 0.02mm / Top CuFoil:007 0.035mm / Dielectric-1 Prepreg:003 0.061mm / Dielectric-2 Prepreg:003 0.061mm / GND CuFoil:007 0.035mm / Dielectric-3 Core:070 0.533mm / PWR_SIG CuFoil:007 0.035mm / Dielectric-4 Prepreg:003 0.061mm / Dielectric-5 Prepreg:003 0.061mm / Bottom CuFoil:007 0.035mm / Bottom Surface Finish Lead-Free 0.02mm / Bottom SolderMask SR:Green 0.0254mm Dk 4.3 / Bottom SilkScreen Epoxy Ink
Design rules: minimum copper width 5mil, minimum drill size 0.15mm, copper clearance wire_polygon to wire_polygon 5mil, copper clearance wire_polygon to pad_smd 5mil, copper clearance wire_polygon to via 5mil, copper clearance pad_smd to pad_smd 5mil, copper clearance pad_smd to via 5mil, copper clearance via to via 5mil, copper clearance smd to pad (same net) 5mil, copper clearance smd to via (same net) 5mil, copper clearance smd to smd (same net) 5mil, dimension clearance 0.2mm, via restrict clearance 0mil, restrict clearance 0mil, drill distance 6mil, keepout clearance 0mil
RestrictTop: area 41.5,12.7 to 45.8,18.8
RestrictBottom: area 41.5,12.6 to 45.9,18.9

### Footprints (pad centres in the part's own frame; a part is rotated, then mirrored left to right if it is on the bottom)
2450AT18B100E_ANTC3216X140N = smd 1.15 x 1.8: 1 -1.5,0; 2 1.5,0
NORDIC_NRF_3_RESC0201_L = smd 0.28 x 0.43: 1 -0.255,0; 2 0.255,0
PERFECT_0402_0402 = smd 0.6 x 0.7: 1 -0.5,0; 2 0.5,0
GRM011R60J152KE01L_1_0201 = smd 0.35 x 0.25: 1 0,0.275; 2 0,-0.275
GRM011R60J152KE01L_2_CAPC0201X13N = smd 0.22 x 0.23: 1 -0.185,0; 2 0.185,0
NORDIC_NRF_3_RESC0402_L = smd 0.5 x 0.6: 1 -0.5,0; 2 0.5,0
ESP32_C6_LIBRARY_5_SOD3716X135N = smd 1.15 x 0.8: 1 -1.75,0; 2 1.75,0
ESP32_C6_LIBRARY_3_SOT95P280X145-6N = smd 1.2 x 0.6: 1 -1.25,0.95; 2 -1.25,0; 3 -1.25,-0.95; 4 1.25,-0.95; 5 1.25,0; 6 1.25,0.95
BQ25180YBGR_BGA8C40P2X4_100X155X50 = smd 0.2 x 0.2: A1 -0.2,0.6; A2 0.2,0.6; B1 -0.2,0.2; B2 0.2,0.2; C1 -0.2,-0.2; C2 0.2,-0.2; D1 -0.2,-0.6; D2 0.2,-0.6
DRV2605YZFR_BGA9C50P3X3_144X144X62 = smd 0.25 x 0.25: A1 -0.5,0.5; A2 0,0.5; A3 0.5,0.5; B1 -0.5,0; B2 0,0; B3 0.5,0; C1 -0.5,-0.5; C2 0,-0.5; C3 0.5,-0.5
BMA423_BMA423 = smd 0.3 x 0.35: 1 -0.75,-0.775; 2 -0.25,-0.775; 3 0.25,-0.775; 4 0.75,-0.775; 7 0.75,0.775; 8 0.25,0.775; 9 -0.25,0.775; 10 -0.75,0.775 | smd 0.35 x 0.3: 5 0.775,-0.25; 6 0.775,0.25; 11 -0.775,0.25; 12 -0.775,-0.25
RT6160AWSC_BGA15C40P3X5_140X230X60 = smd 0.216 x 0.216: A1 -0.4,0.8; A2 0,0.8; A3 0.4,0.8; B1 -0.4,0.4; B2 0,0.4; B3 0.4,0.4; C1 -0.4,0; C2 0,0; C3 0.4,0; D1 -0.4,-0.4; D2 0,-0.4; D3 0.4,-0.4; E1 -0.4,-0.8; E2 0,-0.8; E3 0.4,-0.8
503480-2400_5034802400 = smd 0.3 x 0.7: 1 -5.75,1.525; 2 -5.25,1.525; 3 -4.75,1.525; 4 -4.25,1.525; 5 -3.75,1.525; 6 -3.25,1.525; 7 -2.75,1.525; 8 -2.25,1.525; 9 -1.75,1.525; 10 -1.25,1.525; 11 -0.75,1.525; 12 -0.25,1.525; 13 0.25,1.525; 14 0.75,1.525; 15 1.25,1.525; 16 1.75,1.525; 17 2.25,1.525; 18 2.75,1.525; 19 3.25,1.525; 20 3.75,1.525; 21 4.25,1.525; 22 4.75,1.525; 23 5.25,1.525; 24 5.75,1.525 | smd 0.3 x 1: MP1 -6.54,-1.125; MP2 6.54,-1.125
TC2030-IDC_TC2030IDC = smd 0.783 x 0.783: 1 -0.953,-0.635; 2 -0.953,0.635; 3 0.317,-0.635; 4 0.317,0.635; 5 1.588,-0.635; 6 1.588,0.635 | hole 2.451: -2.223,-2.54; -2.223,2.54; 0.952,-2.54; 0.952,2.54 | hole 1.067: -2.223,0; 2.857,-1.016; 2.857,1.016
KH-TYPE-C-16P_KINGHELM_KH-TYPE-C-16P = smd 0.6 x 1.15: A1_B12 -3.2,4.725; A4_B9 -2.4,4.725; A9_B4 2.4,4.725; A12_B1 3.2,4.725 | smd 0.3 x 1.15: A5 -1.25,4.725; A6 -0.25,4.725; A7 0.25,4.725; A8 1.25,4.725; B5 1.75,4.725; B6 0.75,4.725; B7 -0.75,4.725; B8 -1.75,4.725 | drill 0.65 pad 1.05: SH1 -4.32,0; SH2 4.32,0; SH3 -4.32,4.15; SH4 4.32,4.15 | hole 0.7: -2.89,3.65; 2.89,3.65
NORDIC_NRF_2_RESC0402_L = smd 0.5 x 0.6: 1 -0.5,0; 2 0.5,0
ESP32_C6_LIBRARY_2_IND_4828-WE-TPC_WRE = smd 0.9 x 5.3: 1 -2.286,0; 2 2.286,0
MLP2016SR47MT0S1_INDC2016X100N = smd 1.2 x 2.2: 1 -1.028,0; 2 1.028,0
ESP32_C6_LIBRARY_4_ESP32_C6_LIBRARY_4_ESP32_C6_LIBRARY_4_ESP32_C6_LIBRARY_4_ESP32_WROVER_SPARKFUN-DISCRETESEMI_SOT23-3 = smd 0.8 x 0.9: 1 -0.95,-1; 2 0.95,-1; 3 0,1.1
ESP32_C6_LIBRARY_6_SOT65P210X110-3N = smd 1.05 x 0.5: 1 -1.05,0.65; 2 -1.05,-0.65; 3 1.05,0
ERA-1AEB3401C_0201 = smd 0.35 x 0.25: 1 0,0.275; 2 0,-0.275
CPF0201D7K68C1_0201 = smd 0.35 x 0.25: 1 0,0.275; 2 0,-0.275
ESP32_C6_LIBRARY_7_JUMPER_SJ = smd 1.168 x 1.6: 1 -0.762,0; 2 0.762,0
2025-10-22_07-23-44_LIBRARY_SW_EVP-AKE31A_PAN = smd 0.711 x 1.092: 1 -1.4,-0.972; 2 1.4,-0.972 | drill 0.559 pad 0.914 square: 3 -1.848,0.381; 4 1.848,0.381 | smd 1.397 x 1.092: 5 0,-1.124
HECTOR_WATCH_1_TP20R = smd 2 x 2: TP 0,0
NORDIC_NRF_4_AQFN50P700X700X85_HS-74N = smd 4.85 x 4.85: P$74 0,0 | drill 0.3 pad 0.6: P$75 -1.8,1.8; P$76 -0.6,1.8; P$77 0.6,1.8; P$78 1.8,1.8; P$79 -1.8,0.6; P$80 -0.6,0.6; P$81 0.6,0.6; P$82 1.8,0.6; P$83 -1.8,-0.6; P$84 -0.6,-0.6; P$85 0.6,-0.6; P$86 1.8,-0.6; P$87 -1.8,-1.8; P$88 -0.6,-1.8; P$89 0.6,-1.8; P$90 1.8,-1.8 | smd 0.2 x 0.2: P$A8 -1.25,3.25; P$A10 -0.75,3.25; P$A12 -0.25,3.25; P$A14 0.25,3.25; P$A16 0.75,3.25; P$A18 1.25,3.25; P$A20 1.75,3.25; P$A22 2.25,3.25; P$A23 2.75,3.25; P$AA24 3.25,-2.25; P$AB2 -2.75,-2.5; P$AC5 -2,-2.75; P$AC9 -1,-2.75; P$AC11 -0.5,-2.75; P$AC13 0,-2.75; P$AC15 0.5,-2.75; P$AC17 1,-2.75; P$AC19 1.5,-2.75; P$AC21 2,-2.75; P$AC24 3.25,-2.75; P$AD2 -2.75,-3.25; P$AD4 -2.25,-3.25; P$AD6 -1.75,-3.25; P$AD8 -1.25,-3.25; P$AD10 -0.75,-3.25; P$AD12 -0.25,-3.25; P$AD14 0.25,-3.25; P$AD16 0.75,-3.25; P$AD18 1.25,-3.25; P$AD20 1.75,-3.25; P$AD22 2.25,-3.25; P$AD23 2.75,-3.25; P$B1 -3.25,2.75; P$B3 -2.5,2.75; P$B5 -2,2.75; P$B7 -1.5,2.75; P$B9 -1,2.75; P$B11 -0.5,2.75; P$B13 0,2.75; P$B15 0.5,2.75; P$B17 1,2.75; P$B19 1.5,2.75; P$B24 3.25,2.75; P$C1 -3.25,2.25; P$D2 -2.75,2; P$D23 2.75,2; P$E24 3.25,1.75; P$F2 -2.75,1.5; P$F23 2.75,1.5; P$G1 -3.25,1.25; P$H2 -2.75,1; P$H23 2.75,1; P$J1 -3.25,0.75; P$J24 3.25,0.75; P$K2 -2.75,0.5; P$L1 -3.25,0.25; P$L24 3.25,0.25; P$M2 -2.75,0; P$N1 -3.25,-0.25; P$N24 3.25,-0.25; P$P2 -2.75,-0.5; P$P23 2.75,-0.5; P$R1 -3.25,-0.75; P$R24 3.25,-0.75; P$T2 -2.75,-1; P$T23 2.75,-1; P$U1 -3.25,-1.25; P$U24 3.25,-1.25; P$V23 2.75,-1.5; P$W1 -3.25,-1.75; P$W24 3.25,-1.75; P$Y2 -2.75,-2; P$Y23 2.75,-2
ESP32_C6_LIBRARY_SON50P200X200X80-9N = smd 0.76 x 0.27: 1 -0.985,0.75; 2 -0.985,0.25; 3 -0.985,-0.25; 4 -0.985,-0.75; 5 0.985,-0.75; 6 0.985,-0.25; 7 0.985,0.25; 8 0.985,0.75 | smd 0.9 x 1.3: 9 0,0
NORDIC_NRF_BT-XTAL_2016_N = smd 0.95 x 0.85: 1 -0.725,-0.575; 2 0.725,-0.575; 3 0.725,0.575; 4 -0.725,0.575
NORDIC_NRF_1_XTAL_3215_N = smd 1 x 1.8: 1 -1.25,0; 2 1.25,0

### Placement (x,y rotation side)
ANT1  43.65,16.95 0 top
C1  39.84,18.99 0 top
C1-EP-DR  15.24,19.73 0 top
C2  38.13,21.49 90 top
C2-EP-DR  19.96,12.68 90 top
C3  39.93,15.89 270 top
C4  40.77,18.13 90 top
C5  32.16,19.56 90 top
C6  31.45,13.59 180 top
C7  36.19,11.87 270 top
C8  39.72,12.18 0 top
C9  39.9,14.79 0 top
C10  35.27,22.73 0 top
C11  39.78,18.28 0 top
C12  38.17,19.78 90 top
C13  37.19,19.79 90 top
C14  31.18,20.64 180 top
C15  34.96,21.83 0 top
C16  34.49,20.95 0 top
C17  29.18,18.11 0 top
C18  29.21,15.6 0 top
C19  11.39,7.12 0 top
C20  31.44,12.56 180 top
C21  33.15,10.98 270 top
C22  40.7,15.72 270 top
C23  27.55,23.4 0 top
C24  28.05,22.5 180 top
C25  23.56,21.98 270 top
C27  19.72,26.92 180 top
C29  33.95,5.13 180 top
C30  12.71,5.24 180 top
C31  23.07,5.24 180 top
C32  37.53,8.66 270 top
C33  21.98,22.34 180 top
C34  37.53,4.9 90 top
C37  23.32,25.52 90 top
C38  25.23,25.49 90 top
C39  24.28,25.48 270 top
C42  28.95,28.14 180 top
C43  29.41,29.09 0 top
D2  16.61,10.83 180 top
D3  28.66,25.85 0 top
D4  21.9,10.78 180 top
D5  16.78,12.78 0 top
EPD_C1  12.36,20.6 180 top
EPD_C2  12.37,21.66 180 top
EPD_C5  13.16,17.56 180 top
EPD_C6  12.44,16.51 180 top
EPD_C7  12.58,15.47 180 top
EPD_C8  12.56,14.45 180 top
EPD_C9  12.56,13.42 180 top
EPD_C10  12.36,12.27 180 top
EPD_C11  12.37,11.23 180 top
EPD_C12  12.4,10.12 180 top
IC1  24.1,27.27 270 top
IC2  37.52,6.88 0 top
IC3  10.79,8.55 0 top
IC9  25.65,22.92 270 top
J1  9.1,17.5 270 top
J2  34.79,27.24 0 top
J4  23,33.7 180 top
L1  40.23,16.92 0 top
L2  33.42,19.67 90 top
L3  33.45,21.49 90 top
L5  17.15,16.47 180 top
L7  25.76,20.75 180 top
Q1  20V/4.2A/52mΩ/1.4W  [ESP32_C6_LIBRARY_4_ESP32_C6_LIBRARY_4_ESP32_C6_LIBRARY_4_ESP32_C6_LIBRARY_4_ESP32_WROVER_SPARKFUN-DISCRETESEMI_SOT23-3]  41.95,10.61 270 top
Q3  15.86,21.64 0 top
R1_EP_DR  17.52,21.09 270 top
R1_USB  26.5,27.52 270 top
R2  10.52,7.05 0 top
R2_EP_DR  17.96,22.8 270 top
R2_USB  21.81,27.87 90 top
R3  9.32,7.79 90 top
R4  9.29,8.32 270 top
R5  11.44,5.51 180 top
R7  32.6,5.46 180 top
R8  21.61,5.2 180 top
R9  22.54,27.28 90 top
R17  22.71,21.31 0 top
R18  22.11,21.31 0 top
R_PWR_EPD  40.22,10.64 0 top
R_TYPE_SEL  17.79,20.36 180 top
SJ1  20.04,20.44 180 top
SW_DN  34,3 180 top
SW_ENT  23,3 180 top
SW_UP  12,3 180 top
TP_3.3V  29.9,33.64 0 top
TP_3V3  19.72,22.53 0 top
TP_BAT_GND  21.57,23.89 0 top
TP_GND  32.51,33.64 0 top
TP_ON  39.82,5.04 0 top
TP_OP  39.87,7.61 0 top
TP_RESET  40.23,33.43 0 top
TP_SCL  44.65,27.78 0 top
TP_SDA  44.04,30.24 0 top
TP_SWDCLK  37.73,33.64 0 top
TP_SWDIO  35.09,33.64 0 top
TP_SWO  42.41,32.37 0 top
TP_VBAT  21.43,26.04 0 top
TP_VREG  28.77,20.75 0 top
U1  35.93,15.86 0 top
U3  17.39,26.67 180 top
X1  40.25,21.02 180 top
X2  30.97,16.83 270 top

### Tracks (layer width: path | path; a pad name or v marks a point on that pad's centre or on a via)
3V3  (via drill 0.15, 0.15 pad 0.3, 0.35)
  Top 0.152: 32.68,19.04 U1.P$B1 | IC2.C2 37.52,5.49 37.52,5.42 | IC3.3 11.11,7.7 11.11,7.49 11.13,7.46 C19.1 | U1.P$AD14 36.19,12.59 C7.1 | C34.2 37.87,5.42 37.94,5.42
  Top 0.2: IC9.E3 IC9.E2 | IC9.E3 24.8,22.48 24.34,22.48 | IC9.E3 24.36,23.01 v24.14,23.01
  Top 0.3: 24.34,22.48 C25.1 23.42,22.34 C33.1 22.71,22.11 R17.1 R18.1 20.67,21.58 TP_3V3.TP | 32.66,20.82 32.48,20.64 C14.1 | U1.P$Y2 32.85,13.86 32.68,14.03 U1.P$W1 32.68,14.1 32.17,13.59 C6.1 31.6,13.94 31.6,13.98 31.37,14.22 30.31,14.22 30.14,14.04 v30.14,13.46 | Q1.2 40.97,9.64 | R5.2 11.44,6.12 | 35.99,5.68 36.2,5.68 36.39,5.49 37.52,5.49 | 35.99,5.68 35.25,5.68 34.42,6.51 33.27,6.51 32.87,6.11 32.87,6.01 R7.2 24.77,5.74 24.62,5.89 21.81,5.89 21.61,5.7 R8.2 17.68,9.4 14.51,9.4 | IC3.7 11.62,9.4 12.07,9.4 | 12.07,9.4 14.51,9.4 | TP_3.3V.TP 30.87,32.68 30.87,28.91 31.68,28.1 31.68,26.87 32.2,26.36 32.93,26.36 33.18,26.61 J2.1 34.14,26.3 34.14,23.66 32.85,22.37 32.85,21.8 32.66,21.61 32.66,20.82 | C12.1 U1.P$A22 38.23,19.05 38.23,18.92 38.49,18.66 38.55,18.66 v38.64,18.56 | Q1.2 v40.96,8.72 | 37.52,5.42 37.94,5.42 | 35.99,5.68 35.97,5.66 v35.97,5.33 | 11.44,6.12 11.13,6.42 C19.1 | IC3.10 9.98,9.38 9.98,9.39 9.63,9.75 9.36,9.75 v9.06,10.05 | 11.44,6.12 11.87,6.12 12,5.99 12.51,5.99 13.69,7.17 13.69,8.58 14.51,9.4 | 38.75,12.15 38.71,12.19 38.71,12.35 38.68,12.38 U1.P$AD23 39.1,12.18 C8.1 39.47,11.89 39.27,11.7 39.27,11.06 39.97,10.37 R_PWR_EPD.2 40.28,10.3 40.28,10.23 40.64,9.88 40.73,9.88 Q1.2 | 38.75,12.15 38.75,11.89 38.35,11.49 37.73,11.49 37.06,12.16 36.54,12.16 36.51,12.12 C7.1 | 38.75,12.15 38.95,12.15 38.98,12.18 v39,12.18 | v12.07,9.37 12.07,9.4 | 32.66,20.82 v32.64,20.82 | 32.66,20.82 32.68,20.8 32.68,19.04
  Bottom 0.152: v9.06,10.05 9.12,9.99 9.57,9.99 10.44,9.12 11.79,9.12 12.04,9.37 v12.07,9.37
  Bottom 0.3: 32.66,20.82 30.95,22.53 v30.07,22.53 24.61,22.53 v24.14,23.01 | 37.59,20.74 37.6,20.73 | 37.59,20.74 37.68,20.74 38.76,19.66 38.76,18.57 | v38.64,18.56 v38.65,18.57 38.76,18.57 | v39,12.18 39,12.2 39.3,12.5 39.3,16.86 38.72,17.44 38.72,17.79 38.76,17.83 38.76,18.57 | v32.64,20.82 32.66,20.82 | 32.66,20.82 32.87,21.03 37.3,21.03 37.59,20.74
  PWR_SIG 0.3: 32.72,20.76 32.66,20.82 v32.64,20.82 | v30.07,22.53 30.07,17.22 30.14,17.15 v30.14,13.46 | v40.96,8.72 39.21,6.97 39.21,6.61 37.94,5.33 v35.97,5.33
ALERT  (via drill 0.15 pad 0.3)
  Top 0.152: U1.P$J24 39.06,16.61 38.74,16.29 v38.69,16.29 | U3.5 14.3,27.42 v14.27,27.45
  Bottom 0.152: v23.68,19.48 25.23,17.93 26.15,17.93 26.86,18.63 26.86,18.95 28.16,20.25 36.06,20.25 38.37,17.94 38.37,16.61 v38.69,16.29
  PWR_SIG 0.152: v23.68,19.48 23.18,19.98 22.61,19.98 22.07,20.52 19.43,20.52 17.19,22.77 16.73,22.77 14.27,25.23 v14.27,27.45
D+  (via drill 0.15 pad 0.3)
  Top 0.152: D3.4 29.91,23.96 v29.93,23.94 | U1.P$AD6 34.5,12.29 v34.5,12.1
  PWR_SIG 0.152: v29.93,23.94 30.65,23.22 30.65,14.07 30.79,13.93 30.79,13.56 33.16,11.2 34.16,11.2 34.44,11.48 34.44,12.04 v34.5,12.1
D-  (via drill 0.15 pad 0.3)
  Top 0.152: v31.07,26.79 v31.06,26.8 D3.6 | U1.P$AD4 33.68,12.02 33.95,11.75 v33.95,11.68
  PWR_SIG 0.152: v31.07,26.79 31.38,26.49 31.38,25.64 31.06,25.32 31.06,24.08 31.36,23.78 31.36,14.36 33.68,12.04 33.68,12.02 33.95,11.75 v33.95,11.68
DEC1
  Top 0.152: C5.1 32.29,19.18 32.29,18.75 32.37,18.66 32.37,18.41 U1.P$C1
DEC3
  Top 0.152: U1.P$D23 39.1,18.28 C11.1
DEC4_6  (via drill 0.15)
  Top 0.152: L3.2 34.3,21.99 C15.1 | C15.1 34.46,22.18 C10.1 | C16.1 34.23,21.61 C15.1 | C16.1 34.23,19.34 34.03,19.14 | 34.03,19.14 34.03,19.12 | U1.P$B5 33.93,19.04 34.03,19.14 | v37.5,21.75 36.76,21.75 35.19,20.18 34.63,20.18 34.23,20.58 C16.1 | v39.74,17.66 39.23,17.66 U1.P$E24
  PWR_SIG 0.152: v37.5,21.75 37.5,21.28 37.63,21.15 37.63,18.89 38.52,18.01 39.39,18.01 v39.74,17.66
DN  (via drill 0.15, 0.15 pad 0.3)
  Top 0.152: J4.A7 22.74,28.98 22.74,29.53 22.69,29.58 22.69,30.16 22.99,30.47 23.45,30.47 23.76,30.16 23.76,29.97 | J4.B7 23.75,29.57 23.76,29.58 23.76,29.97 | 23.76,29.97 23.82,30.04 23.82,30.1 24.26,30.54 v24.26,30.79 | v28.35,26.82 28.33,26.8 D3.1
  Bottom 0.152: v24.26,30.79 27.01,28.04 27.49,28.04 27.84,27.69 27.84,27.33 v28.35,26.82
DP  (via drill 0.15 pad 0.3)
  Top 0.152: v22.15,29.91 22.25,29.81 J4.B6 | J4.A6 23.22,29 v23.22,29.94 | v27.43,24.24 27.41,24.26 D3.3
  Bottom 0.152: v22.15,29.91 23.19,29.91 v23.22,29.94 23.82,29.35 24.5,29.35 25.37,28.48 25.37,27.11 27.28,25.2 27.28,24.39 v27.43,24.24
  PWR_SIG 0.152: 22.23,29.91 v22.15,29.91
EPD_3V3  (via drill 0.15 pad 0.3)
  Top 0.152: 14.79,14.77 14.86,14.77 | J1.16 J1.15 10.7,16.32 11.09,16.32 11.25,16.49 11.25,16.97 11.38,17.1
  Top 0.2: Q1.3 41.02,10.61 v40.89,10.48
  Top 0.3: 11.38,17.1 11.49,17.21 12.31,17.21 EPD_C5.2 13.01,17.91 13.01,18.05 13.21,18.26 14.74,18.26 | C1-EP-DR.1 14.74,18.26 | 14.74,18.26 14.86,18.14 L5.2 14.86,14.77 | v13.96,13.94 14.79,14.77
  PWR_SIG 0.3: v13.96,13.94 17.66,10.23 40.64,10.23 v40.89,10.48
EPD_BUSY  (via drill 0.15 pad 0.3)
  Top 0.152: J1.9 11.27,19.25 v11.46,19.06 | U1.P$AD12 35.68,10.36 33.46,8.14 31.48,8.14 26.72,12.9 26.72,13.53 27.82,14.63 v27.82,15.12
  Bottom 0.152: v11.46,19.06 12.05,19.06 12.64,18.47 12.64,18.45 14.43,16.67 25.58,16.67 26.43,15.82 27.14,15.82 27.82,15.14 v27.82,15.12
EPD_CS  (via drill 0.15 pad 0.3)
  Top 0.152: J1.12 11.02,17.75 11.2,17.57 11.67,17.57 11.99,17.88 11.99,17.93 12.67,18.61 13.2,18.61 v13.46,18.87 | U1.P$K2 v33.05,16.48 v33.05,16.49
  Bottom 0.152: v33.05,16.49 32.85,16.49 32.11,17.23 15.1,17.23 v13.46,18.87
EPD_DC  (via drill 0.15 pad 0.3)
  Top 0.152: J1.11 v9.9,18.26 | v27.25,13.12 28.2,13.12 32.9,8.42 33.34,8.42 35.18,10.26 U1.P$AD10
  Bottom 0.152: v9.9,18.26 10.36,18.26 11.09,17.54 11.67,17.54 11.99,17.85 11.99,18.14 12.09,18.24 12.09,18.22 14.2,16.11 24.26,16.11 v27.25,13.12
EPD_RST  (via drill 0.15 pad 0.3)
  Top 0.152: U1.P$AC11 v35.3,12.98 | J1.10 11.02,18.75 11.38,18.39 11.38,18.17 v11.45,18.1
  Bottom 0.152: v28.32,13.76 28.27,13.76 26.49,15.54 26.31,15.54 25.46,16.39 14.31,16.39 12.37,18.34 12.37,18.35 12.2,18.52 11.89,18.52 11.48,18.1 v11.45,18.1
  PWR_SIG 0.152: v28.32,13.76 28.51,13.76 31.35,10.92 34.27,10.92 34.98,11.63 34.98,12.66 v35.3,12.98
GDR
  Top 0.152: J1.2 14.35,22.75 Q3.1 16.27,22.29 16.75,22.77 17.65,22.77 R2_EP_DR.2
GND  (via drill 0.15 pad 0.3)
  Top 0.152: C30.1 13.22,5.25 | 23.91,11.04 D4.1 23.69,10.82 | 12.94,16.69 EPD_C6.1 | J1.MP1 7.94,24.07 | R2_EP_DR.1 18.22,22.82 | EPD_C1.1 | J4.SH2 18.65,33.67 | 32.49,33.63 TP_GND.TP | 35.4,4.26 SW_DN.1 | 30.9,12.6 C20.2 C6.2 | v9.91,15.25 J1.17 | IC1.D2 23.19,27.07 23.02,26.9 22.6,26.9 22.48,27.02 22.48,27.06 R9.1 22.08,27.46 R2_USB.2 | U1.P$B7 34.43,17.95 U1.P$75 | J2.5 36.37,26.59 | J1.MP2 7.97,10.93 | 26.79,27.51 R1_USB.1 | 27.66,23.71 27.65,23.7 | 35.11,26.7 J2.3 J2.5 | U1.P$F23 38.03,17.36 U1.P$78 | J4.SH3 26.75,28.98 J4.A1_B12 | C3.2 40.4,15.63 40.53,15.63 C22.2 | 37.1,27.07 36.64,26.61 J2.5 | C1.2 40.09,18.34 C11.2 | IC9.C2 IC9.C3 | 21.8,19.43 20.8,20.43 SJ1.1 | C33.2 21.48,23.8 TP_BAT_GND.TP | U1.P$74 U1.P$80 | EPD_C10.1 12.88,12.25 EPD_C11.1 | C8.2 39.98,12.25 40.39,12.67
  other vias: 13.98,14.82 16.08,13.09 12.63,7.33 14.34,5.47 25.59,4.83 27.49,27.54 36.28,7.09 36.65,20.6 28.4,33 32.61,32.04 38.66,6.84 40.9,14.47 40.78,13.24 42.09,19.8 24.84,10.84 24.6,33.6 22.8,33.6 21,33.6 17.4,33.6 15.6,33.6 13.8,33.6 12,33.6 10.2,33.6 8.4,33.6 6.6,33.6 4.8,33.6 35.4,31.8 33.6,31.8 31.8,31.8 30,31.8 28.2,31.8 26.4,31.8 21,31.8 19.2,31.8 17.4,31.8 15.6,31.8 13.8,31.8 12,31.8 10.2,31.8 8.4,31.8 6.6,31.8 4.8,31.8 3,31.8 39,30 30,30 28.2,30 17.4,30 15.6,30 13.8,30 12,30 10.2,30 8.4,30 6.6,30 4.8,30 3,30 1.2,30 42.6,28.2 39,28.2 30,28.2 15.6,28.2 13.8,28.2 12,28.2 10.2,28.2 8.4,28.2 6.6,28.2 4.8,28.2 3,28.2 1.2,28.2 44.4,26.4 12,26.4 10.2,26.4 8.4,26.4 6.6,26.4 4.8,26.4 3,26.4 1.2,26.4 44.4,24.6 42.6,24.6 19.2,24.6 17.4,24.6 15.6,24.6 12,24.6 10.2,24.6 8.4,24.6 44.4,22.8 42.6,22.8 39,22.8 15.6,22.8 8.4,22.8 44.4,21 13.8,21 8.4,21 44.4,19.2 42.6,19.2 24.6,19.2 22.8,19.2 21,19.2 17.4,15.6 13.8,15.6 44.4,12 26.4,12 24.6,12 22.8,12 21,12 13.8,12 44.4,10.2 10.2,10.2 44.4,8.4 42.6,8.4 30,8.4 28.2,8.4 26.4,8.4 24.6,8.4 22.8,8.4 21,8.4 17.4,8.4 6.6,8.4 4.8,8.4 3,8.4 1.2,8.4 44.4,6.6 42.6,6.6 40.8,6.6 31.8,6.6 30,6.6 28.2,6.6 26.4,6.6 24.6,6.6 22.8,6.6 19.2,6.6 17.4,6.6 15.6,6.6 12,6.6 28.2,1.2 26.4,1.2 19.2,1.2 17.4,1.2 15.6,1.2 8.4,1.2 6.6,1.2 4.8,1.2 30,1.2 37.2,1.2 39,1.2 40.8,1.2 3,3 4.8,3 6.6,3 12,3 15.6,3 17.4,3 19.2,3 22.8,3 26.4,3 28.2,3 30,3 33.6,3 37.2,3 39,3 40.8,3 42.6,3 1.2,4.8 3,4.8 4.8,4.8 6.6,4.8 10.2,4.8 13.8,4.8 15.6,4.8 17.4,4.8 19.2,4.8 21,4.8 24.6,4.8 26.4,4.8 28.2,4.8 30,4.8 31.8,4.8 35.4,4.8 42.6,4.8 44.4,4.8 1.2,6.6 3,6.6 4.8,6.6 6.6,6.6
  pour GND (isolate 0.2): -0.3,34.88 46.01,34.88 46.01,-1.68 -0.3,-1.68
  pour Top (isolate 0.12): -3.25,37.7 48.33,37.7 48.38,37.65 48.38,-1.82 48.29,-1.91 -3.25,-1.91 -3.29,-1.95 -3.29,37.66
  pour Bottom (isolate 0.12): -3.33,37.76 48.25,37.76 48.25,-1.94 48.13,-2.06 -3.34,-2.06 -3.4,-2.12 -3.4,37.69
HAPTIC_EN  (via drill 0.15 pad 0.3)
  Top 0.152: IC2.A1 36.61,7.79 v36.61,7.88 | U1.P$U1 32.66,14.59 v32.26,14.59
  Bottom 0.152: v36.61,7.88 32.77,7.88 32.36,8.29 32.36,14.49 v32.26,14.59
IMU_INT1  (via drill 0.15 pad 0.3)
  Top 0.152: v12.18,8.27 12.15,8.3 IC3.5 | U1.P$N1 32.17,15.1 31.95,14.88 29.03,14.88 v28.98,14.92
  Bottom 0.152: v12.18,8.27 12.18,8.52 18.57,14.91 19.29,14.91 19.98,15.6 24.02,15.6 27.03,12.58 27.9,12.58 28.68,13.36 28.68,13.91 28.67,13.92 28.67,14.61 v28.98,14.92
IMU_INT2  (via drill 0.15 pad 0.3)
  Top 0.152: U1.P$P2 33.16,15.36 v33.04,15.23 | IC3.6 12.95,8.8 v13.08,8.67
  Bottom 0.152: 13.1,8.65 v13.08,8.67 13.79,8.67 18.75,13.62 25.6,13.62 26.92,12.3 28.02,12.3 28.96,13.24 28.96,14.03 28.95,14.03 28.95,14.33 29.87,15.24 v33.03,15.24 v33.04,15.23
LX1
  Top 0.2: 26.05,22.02 26.06,22.01 IC9.B3 IC9.B2
  Top 0.3: L7.1 26.06,21.48 26.06,22.01
LX2
  Top 0.152: IC9.D2 IC9.D3 25.25,22.01
  Top 0.2: 25.25,22.01
  Top 0.3: L7.2 25.25,21.27 25.25,22.01
MOSI  (via drill 0.15 pad 0.3)
  Top 0.152: v35.98,18.67 U1.P$B13 | J1.14 10.02,16.75 v9.71,16.44
  Bottom 0.152: v35.98,18.67 35.37,18.67 34.94,19.1 28.9,19.1 27.57,17.77 v27.32,17.77
  PWR_SIG 0.152: v9.71,16.44 18.25,16.44 18.49,16.2 26.17,16.2 26.17,16.37 27.32,17.52 v27.32,17.77
N$1
  Top 0.152: L1.2 40.7,16.9 C22.1 | 40.75,16.95 40.77,16.97 C4.1 | 40.75,16.95 L1.2 | 40.75,16.95 ANT1.1 | L1.2
N$2  (via drill 0.15, 0.15 pad 0.3)
  Top 0.152: IC9.D1 v25.25,23.84 v25.24,23.85 | R4.2 8.73,8.6 v8.61,8.6
  Bottom 0.152: v8.61,8.6 8.65,8.55 8.65,7.06 9.96,5.75 13.32,5.75 19.04,11.47 19.04,11.55 v19.12,11.63
  PWR_SIG 0.152: v19.12,11.63 22.75,15.26 26.06,15.26 28.13,17.33 28.13,18.31 28.21,18.39 28.21,19.06 25.79,21.48 25.79,23.93 25.32,23.93 v25.24,23.85
N$3
  Top 0.152: R9.2 22.81,27.45 22.84,27.47 IC1.D1
N$4  (via drill 0.15 pad 0.3)
  Top 0.152: U1.P$A23 38.68,19.6 X1.3 40.02,19.95 v40.02,19.71 | v38.55,20.74 38.55,20.82 C2.1
  PWR_SIG 0.152: v38.55,20.74 38.99,20.74 v40.02,19.71
N$5  (via drill 0.15 pad 0.3)
  Top 0.152: R2.2 10.47,6.72 v10.47,6.28 | IC9.E1 24.46,23.71 v24.19,23.71
  Bottom 0.152: v10.47,6.28 11.81,6.28 12.03,6.06 12.36,6.06 v18.21,11.91
  PWR_SIG 0.152: v18.21,11.91 22.22,15.92 26.32,15.92 27.85,17.45 27.85,18.42 27.93,18.5 27.93,18.95 27.62,19.26 25.89,19.26 24.44,20.71 24.44,22.63 24.62,22.81 24.62,23.21 24.19,23.64 v24.19,23.71
N$6  (via drill 0.15, 0.15 pad 0.3)
  Top 0.152: R1_USB.2 26.23,27.02 v26.3,26.95 v26.3,26.94 | v24.36,29.88 24.36,29.7 24.32,29.66 24.32,29.05 J4.A5
  PWR_SIG 0.152: v24.36,29.88 24.36,29.22 26.3,27.28 v26.3,26.94
N$7
  Top 0.152: L3.1 33.42,20.96 L2.2
N$8
  Top 0.152: R3.2 9.59,7.76 9.61,7.78 IC3.1
N$9  (via drill 0.15 pad 0.3)
  Top 0.152: C1.1 39.56,18.99 U1.P$B24 39.46,18.89 39.46,19.48 v39.32,19.62 | X1.1 41.44,21.13 v41.99,21.13
  PWR_SIG 0.152: v41.99,21.13 40.65,19.79 40.65,19.51 40.37,19.23 39.82,19.23 39.43,19.62 v39.32,19.62
N$10
  Top 0.152: U1.P$H23 38.75,16.86 38.82,16.92 L1.1 | L1.1 39.93,16.71 C3.1 | L1.1
N$11
  Top 0.152: C32.2 37.53,7.57 37.52,7.56 IC2.A2
N$13
  Top 0.152: D2.1 20.1,10.83 D4.2 19.96,10.97 C2-EP-DR.1
N$14
  Top 0.152: C9.1 39.64,15.17 39.21,15.61 U1.P$N24
N$15
  Top 0.152: R1_EP_DR.1 R_TYPE_SEL.2 19.08,20.63 SJ1.2
N$16  (via drill 0.15 pad 0.3)
  Top 0.152: D5.2 19.56,12.78 C2-EP-DR.2 19.44,13.7 L5.1 19.44,16.95 v20.25,17.77 | v16.97,22.23 16.97,21.7 Q3.3
  PWR_SIG 0.152: v20.25,17.77 20.25,18.36 20.08,18.52 17.48,18.52 17.09,18.91 17.09,19.99 16.97,20.11 v16.97,22.23
N$17
  Top 0.152: J1.4 11.78,21.75 EPD_C2.2
N$18
  Top 0.152: J1.5 11.21,21.25 EPD_C1.2
N$20
  Top 0.152: C20.1 32.14,12.56 32.64,13.05 33.3,13.05 33.36,13.11 U1.P$AC5
N$22
  Top 0.152: L2.1 U1.P$B3
N$26
  Top 0.152: J4.B5 21.25,28.15 R2_USB.1
N$30
  Top 0.152: EPD_C6.2 11.94,16.4 11.25,15.71 11.25,14.99 11.09,14.82 10.7,14.82 J1.18
N$31
  Top 0.152: EPD_C7.2 12.08,15.42 10.91,14.25 J1.19
N$32
  Top 0.152: J1.20 11.42,13.75 12.06,14.39 EPD_C8.2
N$34
  Top 0.152: J1.22 10.64,12.76 11,12.76 11.5,12.27 EPD_C10.2
N$35
  Top 0.152: C13.1 U1.P$A18
N$37
  Top 0.152: EPD_C12.2 11.9,10.27 10.62,11.55 J1.24
OUT+
  Top 0.152: IC2.A3 38.24,7.38 38.28,7.41 39.67,7.41 TP_OP.TP
OUT-
  Top 0.152: TP_ON.TP 38.51,6.35 38.28,6.35 38.24,6.38 IC2.C3
P0.00/XL1
  Top 0.152: U1.P$D2 32.86,17.86 32.8,17.8 31.25,17.8 X2.1 30.94,18.11 C17.2
P0.01/XL2
  Top 0.152: U1.P$F2 33.03,17.5 32.39,17.5 30.97,16.08 X2.2 30.95,15.6 C18.2
P0.13
  Top 0.152: R5.1 10.6,4.4 SW_UP.2 | C30.2 R5.1 | R5.1
P0.14
  Top 0.152: SW_ENT.2 R8.1 | R8.1 | C31.2 22.27,4.95 22.19,4.95 22.16,4.91 R8.1
P1.01  (via drill 0.15)
  Top 0.152: U1.P$Y23 38.69,13.84 v38.69,13.36 | R_PWR_EPD.1 40.24,10.94 40.32,10.94 40.93,11.56 Q1.1 40.95,12.04 v40.75,12.25
  PWR_SIG 0.152: v38.69,13.36 39.27,12.78 39.27,12.72 39.75,12.25 v40.75,12.25
P1.02  (via drill 0.15)
  Top 0.152: SW_DN.2 R7.1 33.4,5.19 C29.2 33.48,5.16 v33.48,5.86 | SW_DN.2 | U1.P$W24 39.89,14.11 40.08,14.3 40.22,14.3 41.38,13.14 41.38,12.65 41.43,12.6 41.73,12.6 v42.05,12.28
  PWR_SIG 0.152: v33.48,5.86 33.48,6.31 35.59,8.42 39.84,8.42 42.04,10.62 42.04,12.26 v42.05,12.28
PMIC_INT  (via drill 0.15 pad 0.3)
  Top 0.152: v25.93,18.46 26.78,17.61 26.78,17.13 28.47,15.44 28.47,14.72 28.63,14.57 28.92,14.57 v29.31,14.18 | v25.02,27.79 IC1.A1 | IC1.A1 | U1.P$T2 33.18,14.5 v33.08,14.4
  Bottom 0.152: v25.93,18.46 25.93,20.42 23.64,22.71 23.64,24.75 23.95,25.07 24.32,25.07 24.73,25.48 24.73,27.5 v25.02,27.79 | v29.31,14.18 30.28,14.18 31.06,14.96 32.61,14.96 33.08,14.49 v33.08,14.4
PREVGH
  Top 0.152: J1.21 11.89,13.25 EPD_C9.2 12.61,12.87 12.66,12.87 12.71,12.83 13.47,12.83 13.59,12.95 14.05,12.95 14.21,12.78 D5.1
PREVGL  (via drill 0.15 pad 0.3)
  Top 0.152: J1.23 11.02,12.25 11.25,12.01 11.25,11.94 11.88,11.32 EPD_C11.2 11.94,11.23 12.49,10.68 13.26,10.68 13.65,11.07 v13.9,11.07 14.14,10.83 D2.2
RESE
  Top 0.152: R1_EP_DR.2 14.91,21.09 Q3.2 13.51,22.29 10.66,22.29 J1.3
RESET  (via drill 0.15 pad 0.3)
  Top 0.152: TP_RESET.TP 39,32.2 39,30.75 35.86,27.61 35.86,27.36 | J2.6 35.86,27.36 | v36.06,12.98 U1.P$AC13 | 35.86,27.36 36.84,27.36 v36.97,27.49
  Bottom 0.152: v36.06,12.98 36.26,12.98 36.44,13.16 38,13.16 38.47,12.69 38.47,11.96 38.78,11.64 39.32,11.64 40.24,12.56 40.24,13.24 40.55,13.55 40.55,14.62 40.65,14.72 40.65,24.34 38.46,26.53 38.46,26.56 37.57,27.45 37.02,27.45 v36.97,27.49
SCK  (via drill 0.15 pad 0.3)
  Top 0.152: J1.13 10.23,17.25 10.13,17.35 v9.58,17.35 | U1.P$A12 35.68,19.53 v35.81,19.66
  Bottom 0.152: v35.81,19.66 35.53,19.38 28.69,19.38 28.04,18.73 v27.39,18.73
  PWR_SIG 0.152: v9.58,17.35 17.87,17.35 18.7,16.52 25.19,16.52 v27.39,18.73
SCL  (via drill 0.15 pad 0.3, 0.35)
  Top 0.152: 16.38,26.4 U3.7 15.95,26.42 15.88,26.49 15.42,26.49 15.35,26.42 | TP_SCL.TP 43.69,26.83 v43.36,26.83 | 37,6.36 IC2.C1 36.99,6.35 35.98,6.35 | 15.35,26.53 14.85,26.03 14.85,25.9 15.13,25.62 v15.13,25.13 | 15.35,26.42 15.35,26.53 | 15.35,26.53 15.35,26.54 v15.13,26.76 | IC3.12 9.58,8.3 R4.1 9.56,8.58 9.37,8.78 9.37,9.13 v9.38,9.14 | 35.98,6.35 35.65,6.68 35.65,7.69 36.44,8.48 v36.44,8.96 | U1.P$M2 v33.19,15.84 | 15.35,26.42 | 35.98,6.35 v35.92,6.29 | R17.2 22.71,20.6 v22.77,20.54 | IC1.B1 24.2,27.57 24.2,27.6 v24.2,27.99
  Bottom 0.152: 24.3,27.99 24.3,28.29 19.82,28.29 19.79,28.31 19.35,28.31 19.14,28.11 16.44,28.11 15.13,26.8 v15.13,26.76 v15.12,26.75 | 8.34,9.11 8.34,18.34 v15.13,25.13 | v33.19,15.84 33.44,15.59 33.5,14.39 33.45,14.34 33.45,13.75 34.85,12.35 34.85,10.07 35.97,8.96 v36.44,8.96 | 8.34,9.11 8.07,8.84 8.07,4.61 8.62,4.06 33.69,4.06 v35.92,6.29 | v9.38,9.14 8.36,9.14 8.34,9.11 | v22.77,20.54 22.7,20.61 22.7,24.16 22.56,24.3 22.56,25.69 24.3,27.43 24.3,27.99 | 24.3,27.99 v24.2,27.99
  PWR_SIG 0.152: v43.36,26.83 41.76,26.83 33.52,18.59 33.52,16.17 v33.19,15.84
SDA  (via drill 0.15, 0.15 pad 0.3, 0.2, 0.35)
  Top 0.152: TP_SDA.TP 43.09,29.29 v42.73,29.29 | U3.8 15.66,25.92 v15.65,25.93 | IC1.C1 23.85,27.52 23.85,27.62 23.54,27.93 v23.25,27.93 v23.25,27.94 | v8.37,3.36 8.37,5.52 10.03,7.18 10.37,7.18 R2.1 10.54,7.34 IC3.2 | IC2.B2 v37.53,6.88 | R18.2 22.11,20.28 v21.87,20.04 | U1.P$L1 32.2,16.58 v32.08,16.58
  Bottom 0.152: 21.36,20.27 20.43,21.2 20.43,27.69 | 20.43,27.69 18.23,25.49 16.09,25.49 15.54,26.04 | 8.48,3.78 35.2,3.78 37.53,6.11 v37.53,6.88 | v8.37,3.36 8.37,3.67 8.48,3.78 | 8.48,3.78 7.79,4.47 7.79,8.96 8.06,9.23 8.06,18.82 14.91,25.66 15.16,25.66 15.54,26.04 | v15.65,25.93 15.54,26.04 | 20.43,27.69 20.72,27.98 23.2,27.98 v23.25,27.94 | 21.36,20.27 20.17,19.09 14,19.09 13.68,19.4 13.24,19.4 12.93,19.09 12.93,18.57 14.54,16.95 25.69,16.95 26.07,16.58 v32.08,16.58 | 21.36,20.27 21.52,20.27 21.75,20.04 v21.87,20.04
  PWR_SIG 0.152: v42.73,29.29 38.36,29.29 36.36,31.28 31.95,31.28 31.06,30.4 31.06,30.25 28.17,27.36 28.13,27.36 27.18,26.41 24.78,26.41 v23.25,27.94
SWDCLK  (via drill 0.15, 0.15 pad 0.3)
  Top 0.152: v37.18,31.86 37.18,33.09 TP_SWDCLK.TP | U1.P$AA24 39.29,13.72 40.26,13.72 40.22,13.76 v40.18,13.76 | J2.4 35.11,27.98 v34.48,28.61
  Bottom 0.152: v37.18,31.86 37.18,30.47 37.24,30.4 37.24,29.16 36.36,28.28 35.11,28.28 34.63,28.76 | 34.63,28.76 34.59,28.8 34.59,28.25 36.29,26.55 36.29,26.43 40.37,22.35 40.37,14.84 40.27,14.73 40.27,13.85 v40.18,13.76 | v34.48,28.61 34.63,28.76
SWDIO  (via drill 0.15, 0.15 pad 0.3)
  Top 0.152: TP_SWDIO.TP 34.07,32.62 34.07,29.16 33.84,28.93 J2.2 33.64,28.08 v33.16,28.08 | U1.P$AC24 39.83,13.11 39.83,13 v39.75,12.92
  PWR_SIG 0.152: 30.3,27.47 31.65,27.47 32.26,28.08 v33.16,28.08 | 30.3,27.47 30.21,27.47 | 30.3,27.47 29.25,26.42 29.25,15.87 | 29.25,15.87 29.25,15.49 | 29.25,15.87 27.79,14.41 27.79,12.29 29.44,10.64 39.83,10.64 40.21,11.02 41.17,11.02 41.37,11.22 41.37,12.3 40.95,12.73 40.27,12.73 40.08,12.92 v39.75,12.92
SWO  (via drill 0.15, 0.15 pad 0.3)
  Top 0.152: v41.09,31.49 41.97,32.37 TP_SWO.TP | U1.P$AD22 38.1,12.53 38.1,12.42 37.93,12.25 v37.93,12.15
  Bottom 0.152: v41.09,31.49 41.09,24.3 41.26,24.13 41.26,11.72 40.34,10.8 38.82,10.8 37.93,11.69 v37.93,12.15
VBAT
  Top 0.2: IC1.C2 23.89,26.88 23.7,26.69 23.55,26.69 23.32,26.46
  Top 0.3: 23.32,26.46 C37.2 23.3,26.04 TP_VBAT.TP 20.1,26.04 19.54,26.61 C27.2 U3.3 U3.2
VBUS  (via drill 0.15 pad 0.3)
  Top 0.152: C21.1 33.18,11.51 U1.P$AD2 33,12.61 v32.72,12.32
  Top 0.2: 24.96,27.07 IC1.A2
  Top 0.3: 25.4,28.32 J4.A4_B9 25.25,29.12 25.25,29.7 25.19,29.76 25.19,29.97 24.97,30.19 | 25.23,27.34 C38.2 | 25.23,27.34 24.96,27.07 | C43.1 28.77,28.95 C42.2 28.66,28.04 | C21.1 33.25,11.58 | 28.66,28.04 28.68,28.03 28.68,27.88 28.96,27.59 28.96,26.36 29.16,26.15 29.61,26.15 D3.5 30.73,25.85 31.06,26.18 31.1,26.18 31.1,26.14 v30.84,25.88 | 24.97,30.19 24.99,30.19 | J4.A9_B4 20.75,29.12 20.75,29.7 22.45,31.4 24.51,31.4 24.87,31.04 24.87,30.29 24.97,30.19 | 25.4,28.32 25.48,28.32 25.75,28.05 26.95,28.05 27.02,28.11 28.59,28.11 28.66,28.04 | 25.4,28.32 25.4,28.02 25.45,27.97 25.45,27.56 25.23,27.34
  PWR_SIG 0.3: v30.84,25.88 30.84,25.62 30.71,25.49 30.71,23.93 31.01,23.64 31.01,14.21 32.72,12.5 v32.72,12.32
VREG
  Top 0.152: 24.37,26.06 24.72,25.71 24.72,25.66 24.84,25.54 25.61,25.54 25.74,25.67 25.95,25.67
  Top 0.2: IC9.A1 | 26.95,22.52 IC9.A3 IC9.A2 IC9.A1 | 24.3,25.99 IC1.B2 | IC9.A1 26.45,23.54 26.46,23.54
  Top 0.3: 24.3,25.99 C39.1 24.37,26.06 | C24.2 C23.2 | 26.46,23.54 26.46,25.16 25.95,25.67 | C24.2 26.96,22.5 26.95,22.52 | TP_VREG.TP 28.77,21.14 27.9,22.01 27.9,22.16 C24.2
(copper drawn outside any net)
  shapes: GND area x2

### Text on the board
SilkscreenTop: InkTime Rev B